# Altium project Nixie Alarm Clock - Display.PrjPcb
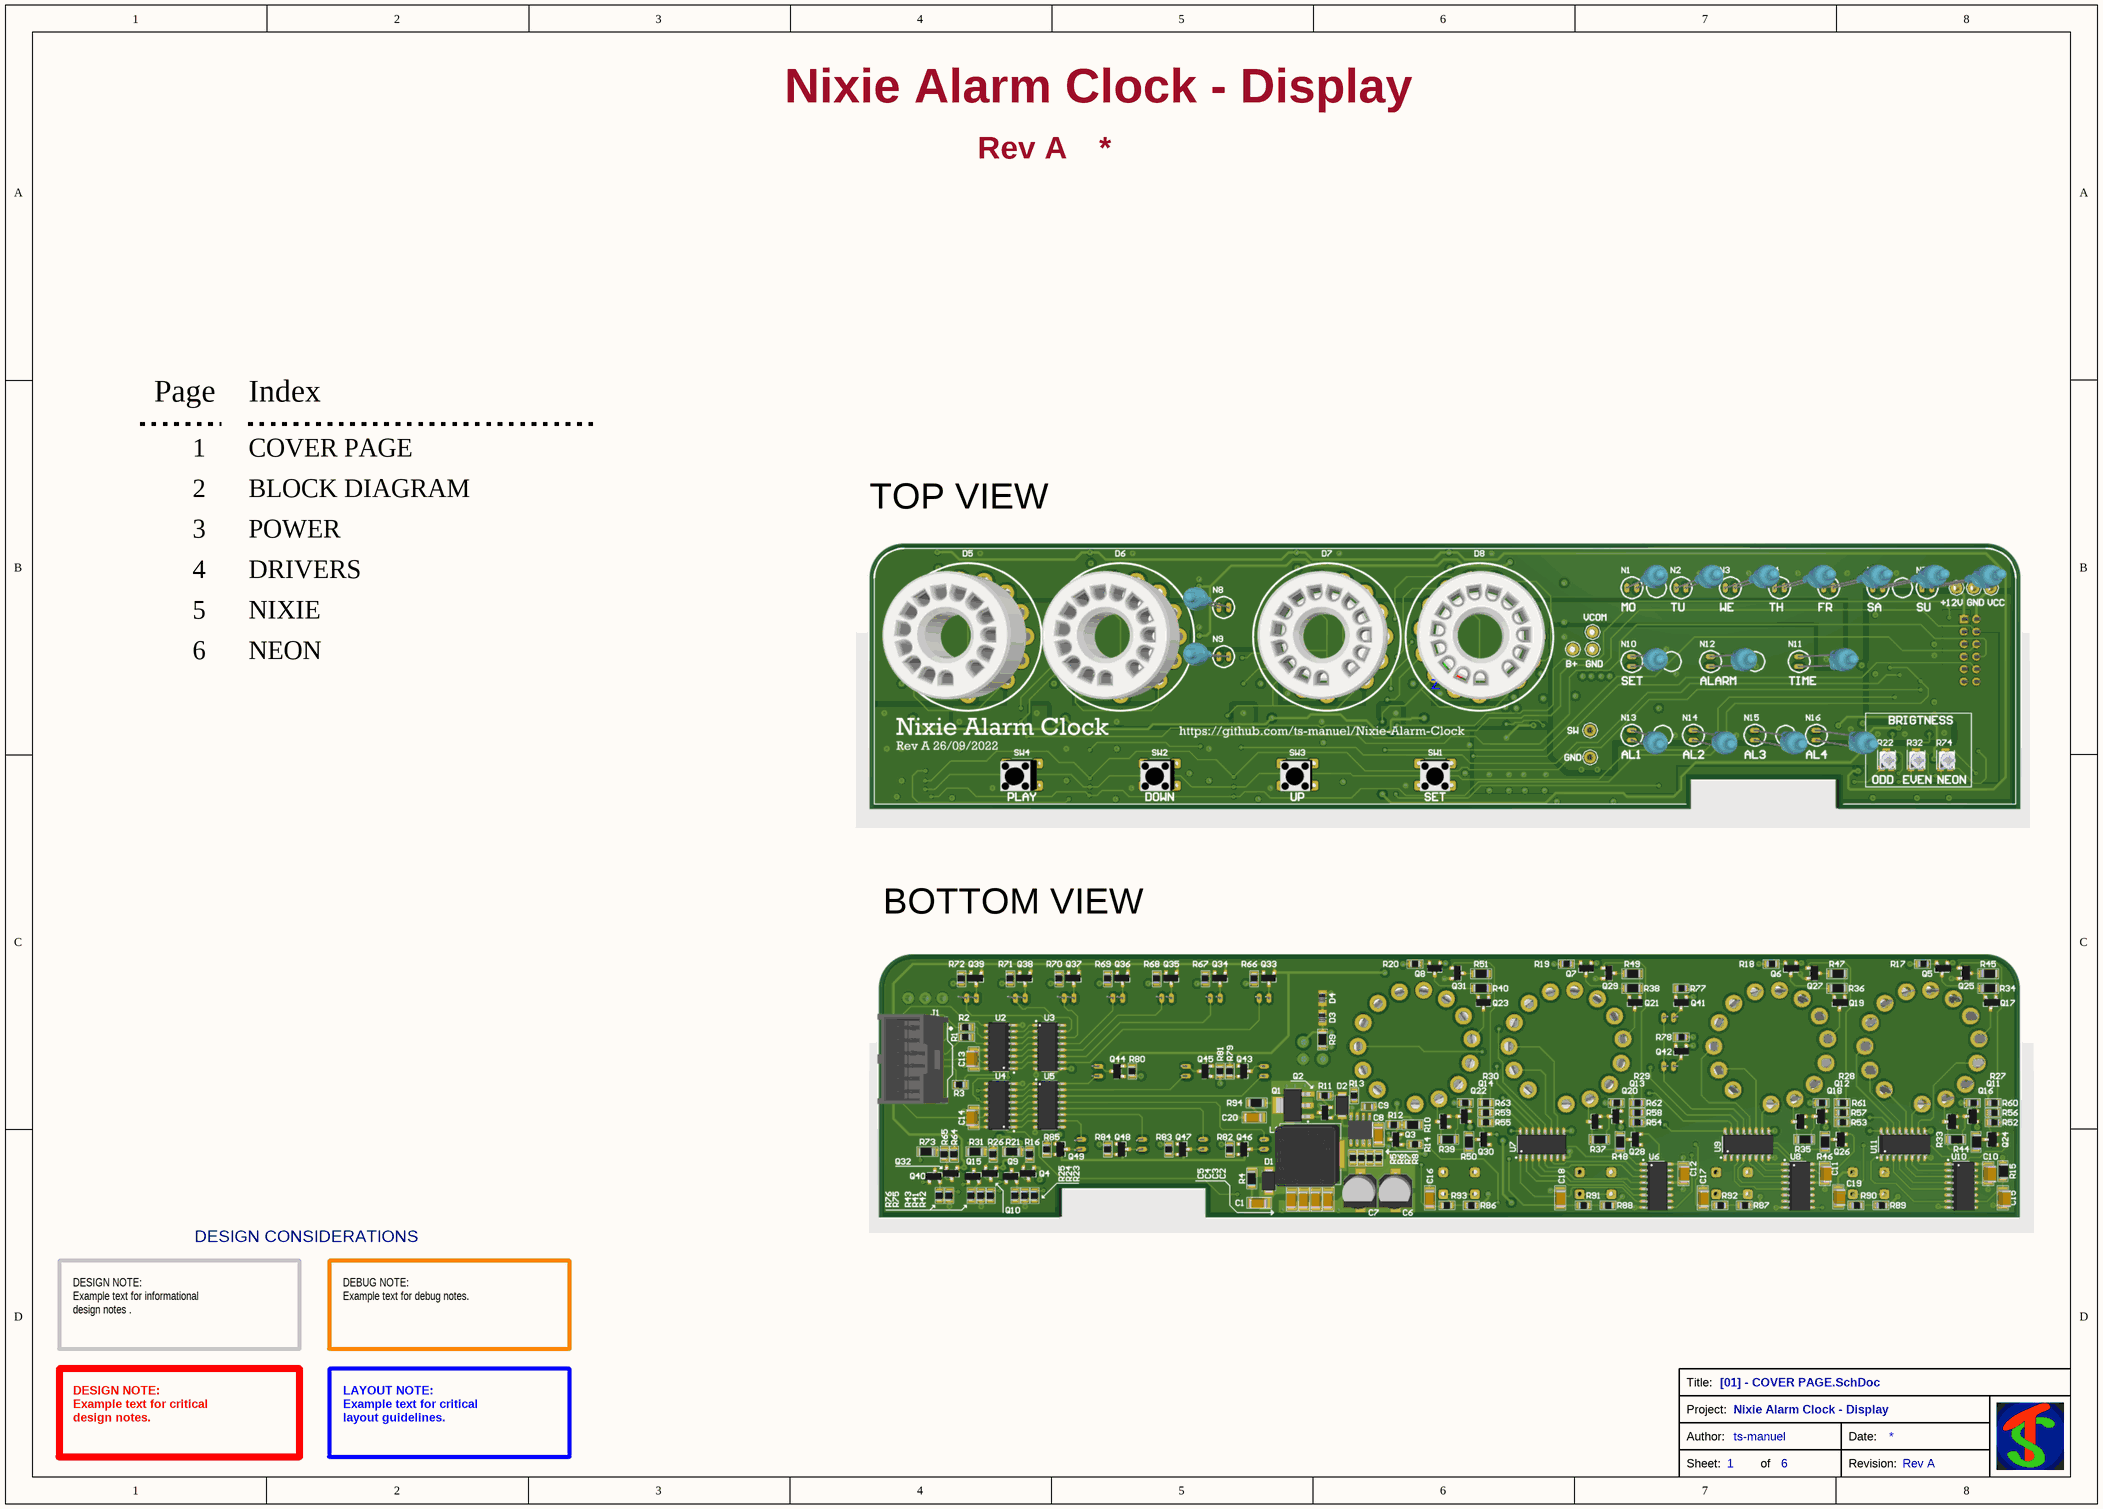
[diagram p0: [01] - COVER PAGE.SchDoc]
AuthorName: ts-manuel; GitHub: https://github.com/ts-manuel/Nixie-Alarm-Clock; ProjectRevision: Rev A; ProjectTitle: Nixie Alarm Clock - Display
6 sheets, 212 parts. Net scope: flat (ports and power ports of the same name join across sheets).
Board file: Display.PcbDoc
Sheets:
  [01] - COVER PAGE.SchDoc
  [02] - BLOCK DIAGRAM.SchDoc
  [03] - POWER.SchDoc
  [04] - DRIVERS.SchDoc
  [05] - NIXIE.SchDoc
  [06] - NEON.SchDoc

## Sheet [01] - COVER PAGE.SchDoc
size A3; DocumentNumber: 1; SheetNumber: 1; SheetTotal: 6

### Notes on the sheet
- Page
- Index
- 1
- 2
- COVER PAGE
- BLOCK DIAGRAM
- TOP VIEW
- 3
- 4
- POWER
- DRIVERS
- 5
- NIXIE
- 6
- NEON
- BOTTOM VIEW
- DESIGN CONSIDERATIONS
- DESIGN NOTE:
  Example text for informational
  design notes .
- DEBUG NOTE:
  Example text for debug notes.
- DESIGN NOTE:
  Example text for critical
  design notes.
- LAYOUT NOTE:
  Example text for critical
  layout guidelines.
- Title:
- Project:
- Sheet:
- Author:
- of
- Revision:
- Date:

## Sheet [02] - BLOCK DIAGRAM.SchDoc
size A3; DocumentNumber: 2; SheetNumber: 2; SheetTotal: 6
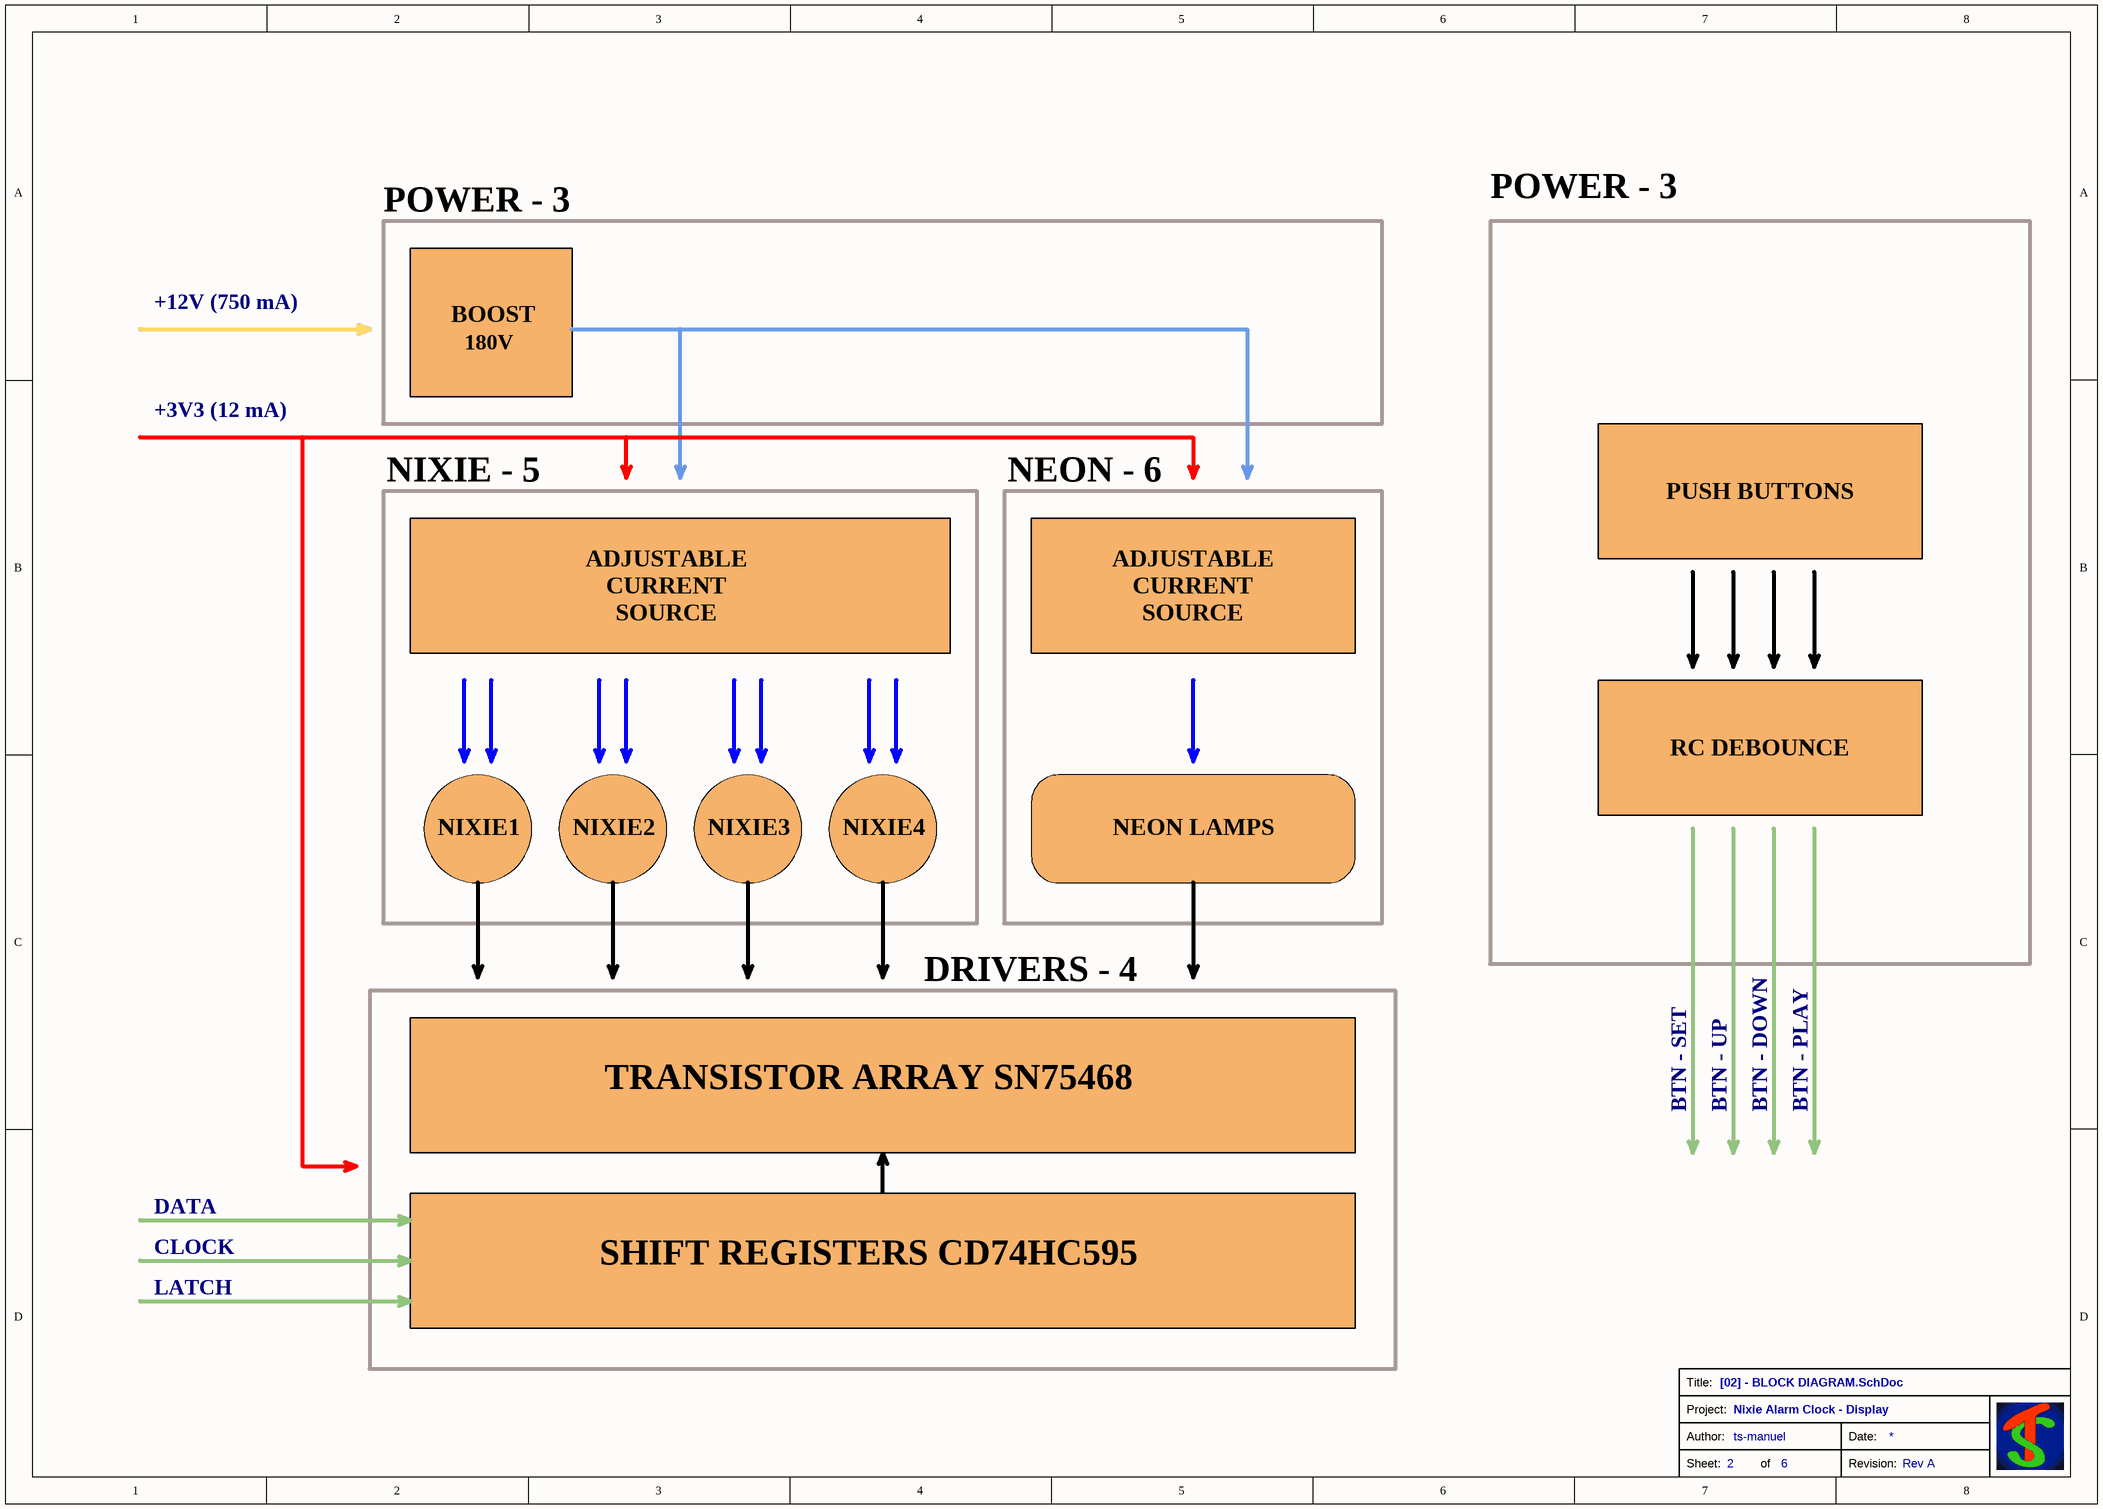
[diagram p1: [02] - BLOCK DIAGRAM.SchDoc]

### Notes on the sheet
- POWER - 3
- +12V (750 mA)
- BOOST
- 180V
- +3V3 (12 mA)
- NIXIE - 5
- NEON - 6
- PUSH BUTTONS
- ADJUSTABLE
- CURRENT
- SOURCE
- RC DEBOUNCE
- NIXIE1
- NIXIE2
- NIXIE3
- NIXIE4
- NEON LAMPS
- DRIVERS - 4
- TRANSISTOR ARRAY SN75468
- BTN - SET
- BTN - UP
- BTN - DOWN
- BTN - PLAY
- DATA
- CLOCK
- LATCH
- SHIFT REGISTERS CD74HC595
- Title:
- Project:
- Sheet:
- Author:
- of
- Revision:
- Date:

## Sheet [03] - POWER.SchDoc
size A3; DocumentNumber: 3; SheetNumber: 3; SheetTotal: 6
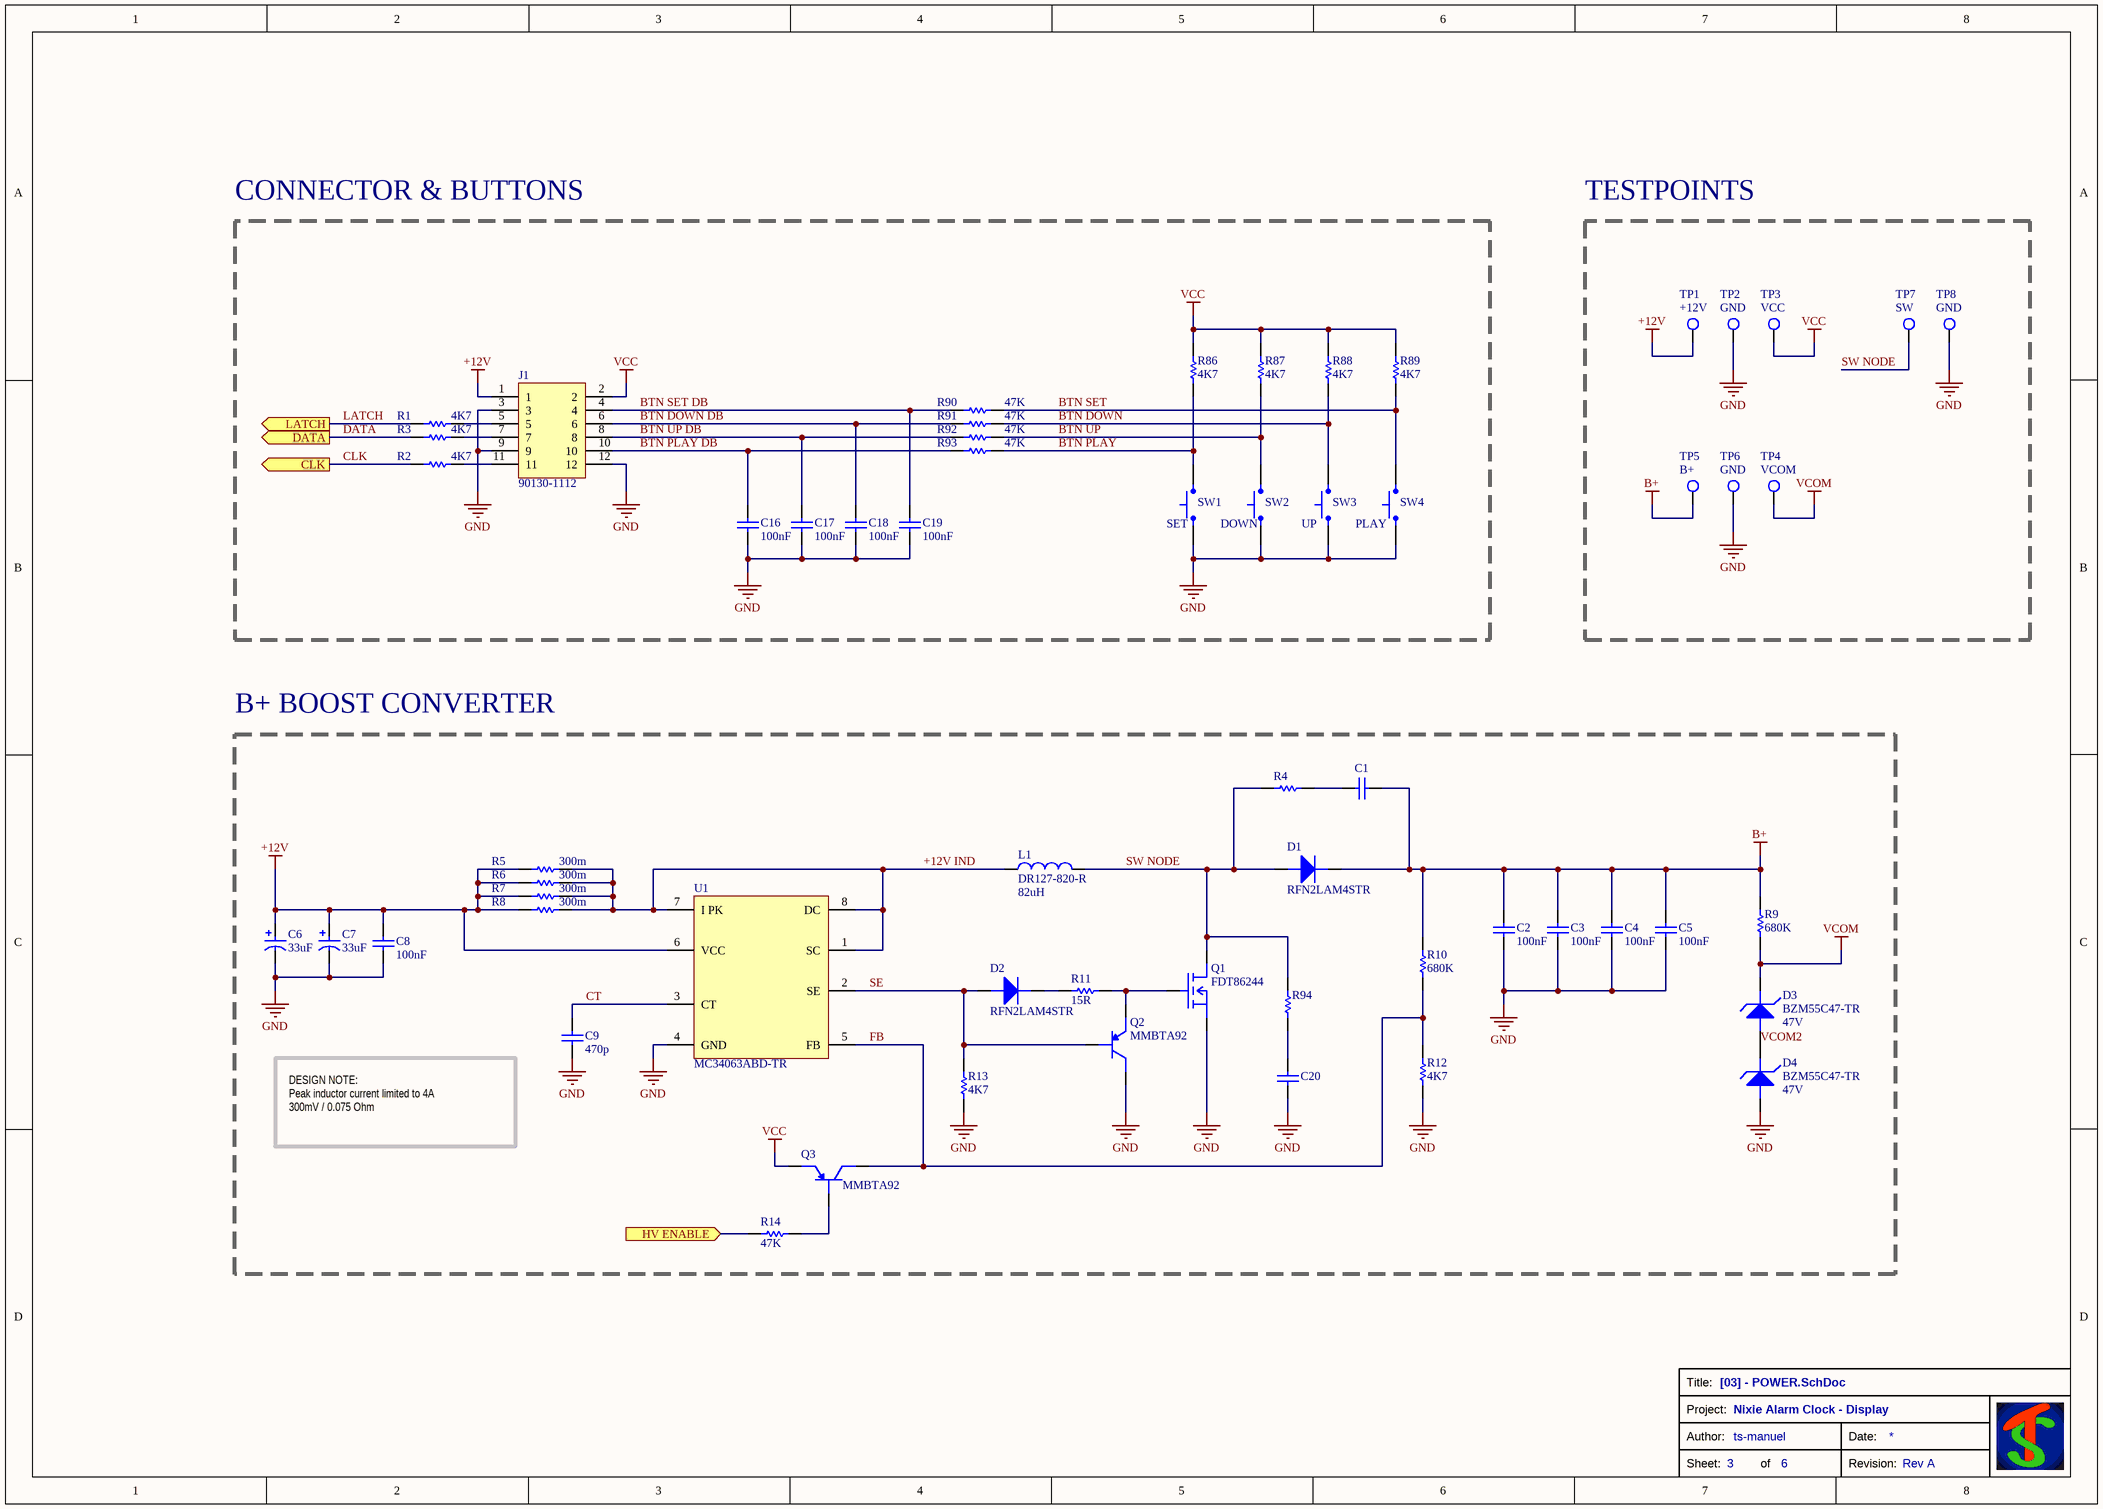
[diagram p2: [03] - POWER.SchDoc]

### Parts
C1  885342208002  [CAP-1206]  (value not drawn)
C2  value 100nF  [CAP-1206]  (hidden comment: 885342208002)
C3  value 100nF  [CAP-1206]  (hidden comment: 885342208002)
C4  value 100nF  [CAP-1206]  (hidden comment: 885342208002)
C5  value 100nF  [CAP-1206]  (hidden comment: 885342208002)
C6  value 33uF  [CAPAE7366X60M]  (hidden comment: A768EB336M1GLAE045)
C7  value 33uF  [CAPAE7366X60M]  (hidden comment: A768EB336M1GLAE045)
C8  value 100nF  [CAP-1206]  (hidden comment: 885342208002)
C9  value 470p  [CAP-0805]  (hidden comment: VJ0805A471JXBCW1BC)
C16  value 100nF  [CAP-1206]  (hidden comment: 885342208002)
C17  value 100nF  [CAP-1206]  (hidden comment: 885342208002)
C18  value 100nF  [CAP-1206]  (hidden comment: 885342208002)
C19  value 100nF  [CAP-1206]  (hidden comment: 885342208002)
C20  885342208002  [CAP-1206]  (value not drawn)
D1  RFN2LAM4STR  [SODFL472X100-2M]
D2  RFN2LAM4STR  [SODFL472X100-2M]
D3  BZM55C47-TR  Zener Voltage: 47V  [DIOMELF1913M]
D4  BZM55C47-TR  Zener Voltage: 47V  [DIOMELF1913M]
J1  90130-1112  [SHDR12W65P254_2X6_1758X975X1110P]
L1  DR127-820-R  value 82uH  [IND-DR127]
Q1  FDT86244  [SOT230P700X180-4M]
Q2  MMBTA92  [SOT95P240X110-3N]
Q3  MMBTA92  [SOT95P240X110-3N]
R1  value 4K7  [RES-0805]  (hidden comment: RT0805FRE134K7L)
R2  value 4K7  [RES-0805]  (hidden comment: RT0805FRE134K7L)
R3  value 4K7  [RES-0805]  (hidden comment: RT0805FRE134K7L)
R4  RT1206FRE07680KL  [RES-1206]  (value not drawn)
R5  value 300m  [RES-0805]  (hidden comment: ERJ-U6QFR30V)
R6  value 300m  [RES-0805]  (hidden comment: ERJ-U6QFR30V)
R7  value 300m  [RES-0805]  (hidden comment: ERJ-U6QFR30V)
R8  value 300m  [RES-0805]  (hidden comment: ERJ-U6QFR30V)
R9  value 680K  [RES-1206]  (hidden comment: RT1206FRE07680KL)
R10  value 680K  [RES-1206]  (hidden comment: RT1206FRE07680KL)
R11  value 15R  [RES-0805]  (hidden comment: CR0805-JW-150ELF)
R12  value 4K7  [RES-0805]  (hidden comment: RT0805FRE134K7L)
R13  value 4K7  [RES-0805]  (hidden comment: RT0805FRE134K7L)
R14  value 47K  [RES-0805]  (hidden comment: RT0805FRE0747KL)
R86  value 4K7  [RES-0805]  (hidden comment: RT0805FRE134K7L)
R87  value 4K7  [RES-0805]  (hidden comment: RT0805FRE134K7L)
R88  value 4K7  [RES-0805]  (hidden comment: RT0805FRE134K7L)
R89  value 4K7  [RES-0805]  (hidden comment: RT0805FRE134K7L)
R90  value 47K  [RES-0805]  (hidden comment: RT0805FRE0747KL)
R91  value 47K  [RES-0805]  (hidden comment: RT0805FRE0747KL)
R92  value 47K  [RES-0805]  (hidden comment: RT0805FRE0747KL)
R93  value 47K  [RES-0805]  (hidden comment: RT0805FRE0747KL)
R94  RT1206FRE07680KL  [RES-1206]  (value not drawn)
SW1  SET  [Push Button 6mm TH]
SW2  DOWN  [Push Button 6mm TH]
SW3  UP  [Push Button 6mm TH]
SW4  PLAY  [Push Button 6mm TH]
TP1  +12V  [TESTPOINT-TH-1.3mm]  (no BOM)
TP2  GND  [TESTPOINT-TH-1.3mm]  (no BOM)
TP3  VCC  [TESTPOINT-TH-1.3mm]  (no BOM)
TP4  VCOM  [TESTPOINT-TH-1.3mm]  (no BOM)
TP5  B+  [TESTPOINT-TH-1.3mm]  (no BOM)
TP6  GND  [TESTPOINT-TH-1.3mm]  (no BOM)
TP7  SW  [TESTPOINT-TH-1.3mm]  (no BOM)
TP8  GND  [TESTPOINT-TH-1.3mm]  (no BOM)
U1  MC34063ABD-TR  [SOIC-8_3.9X4.9]

### Blocks framed on the sheet
CONNECTOR & BUTTONS: C16-C19 J1 R1-R3 R86-R93 SW1-SW4
TESTPOINTS: TP1-TP8
B+ BOOST CONVERTER: C1-C9 C20 D1-D4 L1 Q1-Q3 R4-R14 R94 U1

### Ports
CLK (out), DATA (out), HV ENABLE (in), LATCH (out)

### Nets
+12V: C6.1(P) C7.1(P) C8.2 J1.1 R5.1 R6.1 R7.1 R8.1 TP1.1 U1.6(VCC)
B+: C1.1 C2.2 C3.2 C4.2 C5.2 D1.2(C) R9.2 R10.2 TP5.1
GND: C2.1 C3.1 C4.1 C5.1 C6.2(N) C7.2(N) C8.1 C9.1 C16.1 C17.1 C18.1 C19.1 C20.1 D4.1(A) J1.3 J1.9 J1.12 Q1.3(SOURCE) Q2.3(C) R12.1 R13.1 SW1.1 SW2.1 SW3.1 SW4.1 TP2.1 TP6.1 TP8.1 U1.4(GND)
VCC: J1.2 Q3.2(E) R86.2 R87.2 R88.2 R89.2 TP3.1
VCOM: D3.2(C) R9.1 TP4.1
+12V IND: L1.1 R5.2 R6.2 R7.2 R8.2 U1.1(SC) U1.7(I_PK) U1.8(DC)
BTN DOWN: R88.1 R91.2 SW3.2
BTN DOWN DB: C18.2 J1.6 R91.1
BTN PLAY: R86.1 R93.2 SW1.2
BTN PLAY DB: C16.2 J1.10 R93.1
BTN SET: R89.1 R90.2 SW4.2
BTN SET DB: C19.2 J1.4 R90.1
BTN UP: R87.1 R92.2 SW2.2
BTN UP DB: C17.2 J1.8 R92.1
CLK: R2.1 ; port CLK
CT: C9.2 U1.3(CT)
DATA: R3.1 ; port DATA
FB: Q3.3(C) R10.1 R12.2 U1.5(FB)
HV ENABLE: R14.1 ; port HV ENABLE
LATCH: R1.1 ; port LATCH
SE: D2.1(A) Q2.1(B) R13.2 U1.2(SE)
SW NODE: D1.1(A) L1.2 Q1.2(DRAIN) R4.2 R94.2 TP7.1
VCOM2: D3.1(A) D4.2(C)
NetC1_2: C1.2 R4.1
NetC20_2: C20.2 R94.1
NetD2_2: D2.2(C) R11.1
NetJ1_5: J1.5 R1.2
NetJ1_7: J1.7 R3.2
NetJ1_11: J1.11 R2.2
NetQ1_1: Q1.1(GATE) Q2.2(E) R11.2
NetQ3_1: Q3.1(B) R14.2

### Notes on the sheet
- DESIGN NOTE:
  Peak inductor current limited to 4A
  300mV / 0.075 Ohm
  Max output current 40mA
- Title:
- Project:
- Sheet:
- Author:
- of
- Revision:
- Date:

### Library data of the parts
C1 C20 = CAP-1206-100n-885342208002: Condensatori in ceramica multistrato MLCC - SMD/SMT WCAP-CSMH 200V 0.1uF 1206 10%; Manufacturer: Wurth Elektronik; Dielectric: X7R; Value: 100nF; Voltage Rating: 200V; Tolerance: 10%; Supplier 1: Mouser; Supplier Part Number 1: 710-885342208002
C2-C5 C8 C16-C19 = CAP-1206-100n-885342208002: Condensatori in ceramica multistrato MLCC - SMD/SMT WCAP-CSMH 200V 0.1uF 1206 10%; Manufacturer: Wurth Elektronik; Dielectric: X7R; Voltage Rating: 200V; Tolerance: 10%; Supplier 1: Mouser; Supplier Part Number 1: 710-885342208002
C6 C7 = CAP-CAN-33u-A768EB336M1GLAE045: Condensatori a polimeri organici in alluminio 40V 33uF 20% ESR=45mOhms; Manufacturer: KEMET; Voltage Rating DC: 16 VDC; Voltage Rating: 16V; Dielectric: X7R; Tolerance: 20%; Supplier 1: Mouser; Supplier Part Number 1: 80-A768EB336M1GLAE45
C9 = CAP-0805-470p-VJ0805A471JXBCW1BC: Condensatori in ceramica multistrato MLCC - SMD/SMT 0805 470pF 100volts C0G 5%; Manufacturer: Wurth Elektronik; Voltage Rating DC: 16 VDC; Voltage Rating: 16V; Tolerance: 20%; Dielectric: X5R; Supplier 1: Mouser; Supplier Part Number 1: 77-VJ0805A471JXBCBC
D1 D2 = DIODE-RFN2LAM4STR: Diodi - Uso generico, alimentazione, commutazione 400V 1.5A Io PMDTM; Supplier 1: Mouser; Supplier Part Number 1: 755-RFN2LAM4STR; Reverse Voltage: 400V; Forward Current: 1.5A
D3 D4 = ZENER-47V-BZM55C47-TR: Diodi Zener 47 Volt 0.5W 5%; Supplier 1: Mouser; Supplier Part Number 1: 78-BZM55C47
J1 = HEADER-12x2-2.54-TH-90130-1112: Terminali e capicorda 2.54MM CGRIDIII HDR 12P V DR SHRD TIN; Manufacturer_Name: Molex; Datasheet Link: https://www.molex.com/pdm_docs/sd/901301112_sd.pdf; Height: 11.1mm; Manufacturer_Part_Number: 90130-1112; Supplier 1: Mouser; Supplier Part Number 1: 538-90130-1112
L1 = IND-DR127-82u: Induttori fissi 82uH 4.0A 0.143ohms; Manufacturer: Taiyo Yuden; Tolerance: 30%; Max DC Current: 4A; Max DC Resistance: 143m; Supplier 1: Mouser; Supplier Part Number 1: 704-DR127-820-R
Q1 = NMOS-FDT86244: MOSFET 150V N-Channel PowerTrench MOSFET; Supplier 1: Mouser; Supplier Part Number 1: 512-FDT86244
Q2 Q3 = PNP-MMBTA92: 300V PNP SMALL SIGNAL TRANSISTOR IN SOT23; Supplier 1: Mouser; Supplier Part Number 1: 621-MMBTA92-F
R1-R3 R12 R13 R86-R89 = RES-0805-4K7-RT0805FRE134K7L: Thin Film Resistors 4.7K ohm 1% 50 ppm; Manufacturer: Yageo; Power Rating: 1/10W; Voltage Rating: 75V; Tolerance: 1%; Supplier 1: Mouser; Supplier Part Number 1: 603-RT0805FRE134K7L
R4 R9 R10 R94 = RES-1206-680K-RT1206FRE07680KL: Thin Film Resistors 680K OHM 1% 50PPM 1/4W; Manufacturer: Yageo; Power Rating: 1/10W; Voltage Rating: 75V; Tolerance: 1%; Supplier 1: Mouser; Supplier Part Number 1: 603-RT1206FRE07680KL
  R4 R94: Value: 680K
R5-R8 = RES-0805-300m-ERJ-U6QFR30V: Resistori a pellicola spessa - SMD 0805 0.25W 1% .30ohms AEC-Q200; Manufacturer: Yageo; Power Rating: 1/10W; Voltage Rating: 75V; Tolerance: 1%; Supplier 1: Mouser; Supplier Part Number 1: 667-ERJ-U6QFR30V
R11 = RES-0805-15R-ERJ-CR0805-JW-150ELF: Resistori a pellicola spessa - SMD 15ohm 5%; Manufacturer: Bourns; Power Rating: 1/8W; Voltage Rating: 150V; Tolerance: 5%; Supplier 1: Mouser; Supplier Part Number 1: 652-CR0805JW-150ELF
R14 R90-R93 = RES-0805-47K-RT0805FRE0747KL: Thin Film Resistors 1/8W 47K ohm 1% 50ppm; Manufacturer: Yageo; Power Rating: 1/10W; Voltage Rating: 75V; Tolerance: 1%; Supplier 1: Mouser; Supplier Part Number 1: 603-RT0805FRE0747KL
SW1-SW4 = Push Button 6mm TH
TP1-TP8 = TESTPOINT-TH-1.3mm
U1 = MC34063ABD-TR: DC-DC Converter 3.0 to 40V; Supplier 1: Mouser; Supplier Part Number 1: 511-MC34063ABD-TR

## Sheet [04] - DRIVERS.SchDoc
size A3; DocumentNumber: 4; SheetNumber: 4; SheetTotal: 6
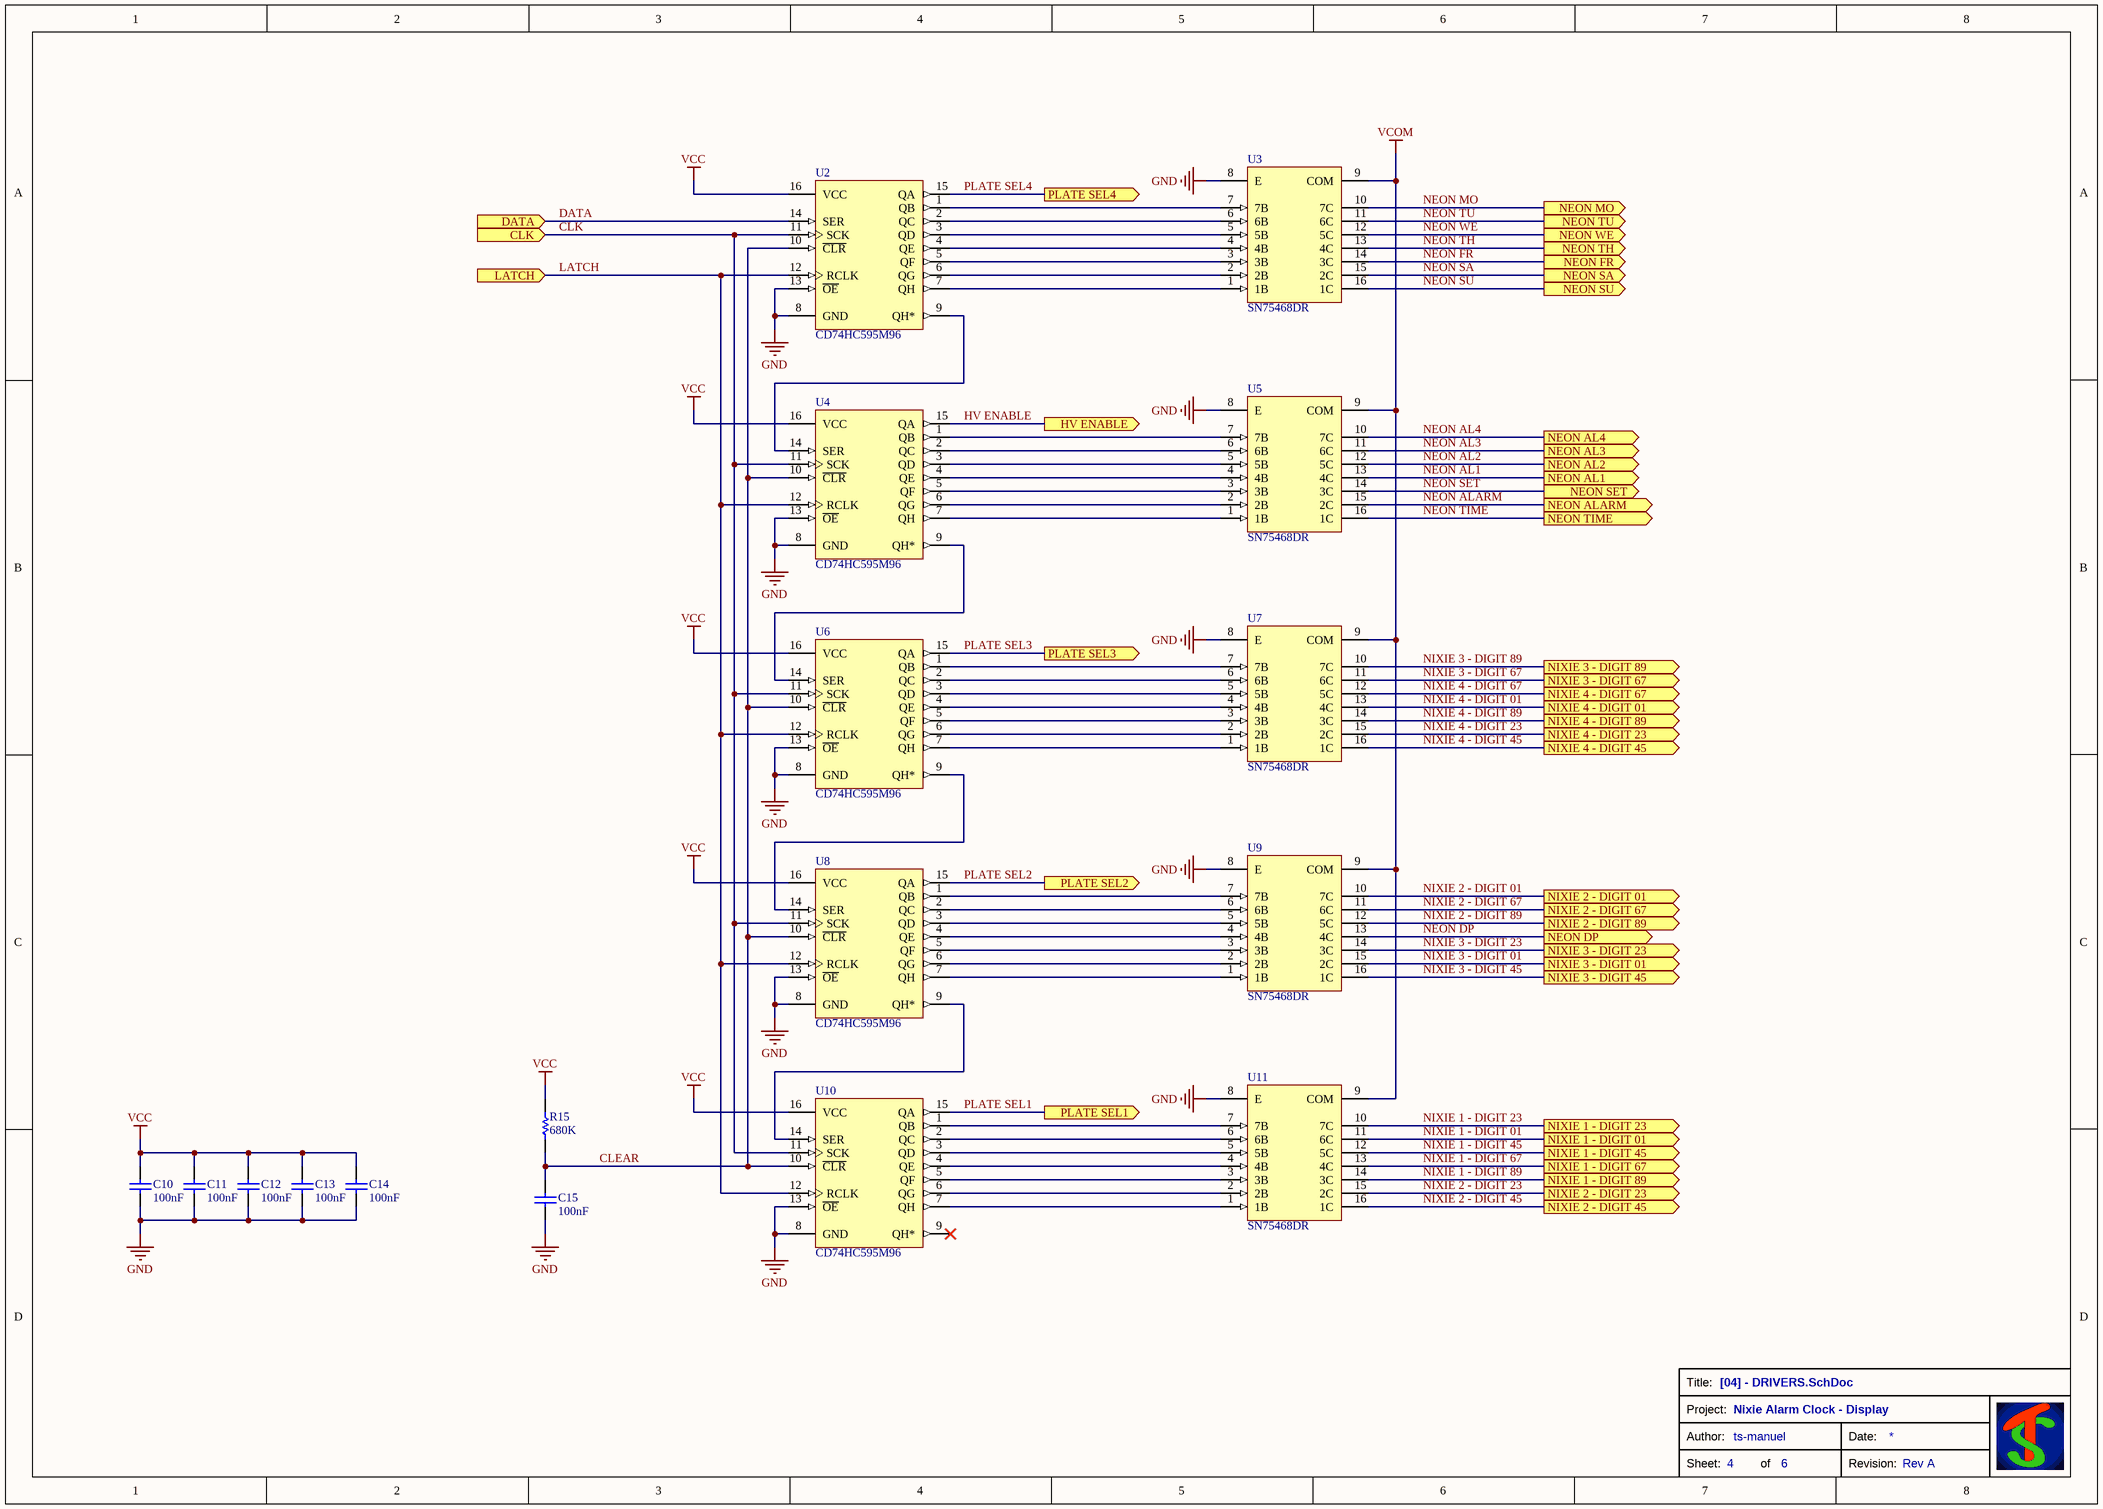
[diagram p3: [04] - DRIVERS.SchDoc]

### Parts
C10  value 100nF  [CAP-1206]  (hidden comment: 885342208002)
C11  value 100nF  [CAP-1206]  (hidden comment: 885342208002)
C12  value 100nF  [CAP-1206]  (hidden comment: 885342208002)
C13  value 100nF  [CAP-1206]  (hidden comment: 885342208002)
C14  value 100nF  [CAP-1206]  (hidden comment: 885342208002)
C15  value 100nF  [CAP-1206]  (hidden comment: 885342208002)
R15  value 680K  [RES-1206]  (hidden comment: RT1206FRE07680KL)
U2  CD74HC595M96  [SOIC127P600X175-16N]
U3  SN75468DR  [SOIC127P600X175-16N]
U4  CD74HC595M96  [SOIC127P600X175-16N]
U5  SN75468DR  [SOIC127P600X175-16N]
U6  CD74HC595M96  [SOIC127P600X175-16N]
U7  SN75468DR  [SOIC127P600X175-16N]
U8  CD74HC595M96  [SOIC127P600X175-16N]
U9  SN75468DR  [SOIC127P600X175-16N]
U10  CD74HC595M96  [SOIC127P600X175-16N]
U11  SN75468DR  [SOIC127P600X175-16N]

### Ports
CLK (in), DATA (in), HV ENABLE (out), LATCH (in), NEON AL1 (out), NEON AL2 (out), NEON AL3 (out), NEON AL4 (out), NEON ALARM (out), NEON DP (out), NEON FR (out), NEON MO (out), NEON SA (out), NEON SET (out), NEON SU (out), NEON TH (out), NEON TIME (out), NEON TU (out), NEON WE (out), NIXIE 1 - DIGIT 01 (out), NIXIE 1 - DIGIT 23 (out), NIXIE 1 - DIGIT 45 (out), NIXIE 1 - DIGIT 67 (out), NIXIE 1 - DIGIT 89 (out), NIXIE 2 - DIGIT 01 (out), NIXIE 2 - DIGIT 23 (out), NIXIE 2 - DIGIT 45 (out), NIXIE 2 - DIGIT 67 (out), NIXIE 2 - DIGIT 89 (out), NIXIE 3 - DIGIT 01 (out), NIXIE 3 - DIGIT 23 (out), NIXIE 3 - DIGIT 45 (out), NIXIE 3 - DIGIT 67 (out), NIXIE 3 - DIGIT 89 (out), NIXIE 4 - DIGIT 01 (out), NIXIE 4 - DIGIT 23 (out), NIXIE 4 - DIGIT 45 (out), NIXIE 4 - DIGIT 67 (out), NIXIE 4 - DIGIT 89 (out), PLATE SEL1 (out), PLATE SEL2 (out), PLATE SEL3 (out), PLATE SEL4 (out)

### Nets
GND: C10.1 C11.1 C12.1 C13.1 C14.1 C15.1 U2.8(GND) U2.13(~{OE}) U3.8(E) U4.8(GND) U4.13(~{OE}) U5.8(E) U6.8(GND) U6.13(~{OE}) U7.8(E) U8.8(GND) U8.13(~{OE}) U9.8(E) U10.8(GND) U10.13(~{OE}) U11.8(E)
VCC: C10.2 C11.2 C12.2 C13.2 C14.2 R15.2 U2.16(VCC) U4.16(VCC) U6.16(VCC) U8.16(VCC) U10.16(VCC)
VCOM: U3.9(COM) U5.9(COM) U7.9(COM) U9.9(COM) U11.9(COM)
CLEAR: C15.2 R15.1 U2.10(~{CLR}) U4.10(~{CLR}) U6.10(~{CLR}) U8.10(~{CLR}) U10.10(~{CLR})
CLK: U2.11(SCK) U4.11(SCK) U6.11(SCK) U8.11(SCK) U10.11(SCK) ; port CLK
DATA: U2.14(SER) ; port DATA
HV ENABLE: U4.15(QA) ; port HV ENABLE
LATCH: U2.12(RCLK) U4.12(RCLK) U6.12(RCLK) U8.12(RCLK) U10.12(RCLK) ; port LATCH
NEON AL1: U5.13(4C) ; port NEON AL1
NEON AL2: U5.12(5C) ; port NEON AL2
NEON AL3: U5.11(6C) ; port NEON AL3
NEON AL4: U5.10(7C) ; port NEON AL4
NEON ALARM: U5.15(2C) ; port NEON ALARM
NEON DP: U9.13(4C) ; port NEON DP
NEON FR: U3.14(3C) ; port NEON FR
NEON MO: U3.10(7C) ; port NEON MO
NEON SA: U3.15(2C) ; port NEON SA
NEON SET: U5.14(3C) ; port NEON SET
NEON SU: U3.16(1C) ; port NEON SU
NEON TH: U3.13(4C) ; port NEON TH
NEON TIME: U5.16(1C) ; port NEON TIME
NEON TU: U3.11(6C) ; port NEON TU
NEON WE: U3.12(5C) ; port NEON WE
NIXIE 1 - DIGIT 01: U11.11(6C) ; port NIXIE 1 - DIGIT 01
NIXIE 1 - DIGIT 23: U11.10(7C) ; port NIXIE 1 - DIGIT 23
NIXIE 1 - DIGIT 45: U11.12(5C) ; port NIXIE 1 - DIGIT 45
NIXIE 1 - DIGIT 67: U11.13(4C) ; port NIXIE 1 - DIGIT 67
NIXIE 1 - DIGIT 89: U11.14(3C) ; port NIXIE 1 - DIGIT 89
NIXIE 2 - DIGIT 01: U9.10(7C) ; port NIXIE 2 - DIGIT 01
NIXIE 2 - DIGIT 23: U11.15(2C) ; port NIXIE 2 - DIGIT 23
NIXIE 2 - DIGIT 45: U11.16(1C) ; port NIXIE 2 - DIGIT 45
NIXIE 2 - DIGIT 67: U9.11(6C) ; port NIXIE 2 - DIGIT 67
NIXIE 2 - DIGIT 89: U9.12(5C) ; port NIXIE 2 - DIGIT 89
NIXIE 3 - DIGIT 01: U9.15(2C) ; port NIXIE 3 - DIGIT 01
NIXIE 3 - DIGIT 23: U9.14(3C) ; port NIXIE 3 - DIGIT 23
NIXIE 3 - DIGIT 45: U9.16(1C) ; port NIXIE 3 - DIGIT 45
NIXIE 3 - DIGIT 67: U7.11(6C) ; port NIXIE 3 - DIGIT 67
NIXIE 3 - DIGIT 89: U7.10(7C) ; port NIXIE 3 - DIGIT 89
NIXIE 4 - DIGIT 01: U7.13(4C) ; port NIXIE 4 - DIGIT 01
NIXIE 4 - DIGIT 23: U7.15(2C) ; port NIXIE 4 - DIGIT 23
NIXIE 4 - DIGIT 45: U7.16(1C) ; port NIXIE 4 - DIGIT 45
NIXIE 4 - DIGIT 67: U7.12(5C) ; port NIXIE 4 - DIGIT 67
NIXIE 4 - DIGIT 89: U7.14(3C) ; port NIXIE 4 - DIGIT 89
PLATE SEL1: U10.15(QA) ; port PLATE SEL1
PLATE SEL2: U8.15(QA) ; port PLATE SEL2
PLATE SEL3: U6.15(QA) ; port PLATE SEL3
PLATE SEL4: U2.15(QA) ; port PLATE SEL4
NetU2_1: U2.1(QB) U3.7(7B)
NetU2_2: U2.2(QC) U3.6(6B)
NetU2_3: U2.3(QD) U3.5(5B)
NetU2_4: U2.4(QE) U3.4(4B)
NetU2_5: U2.5(QF) U3.3(3B)
NetU2_6: U2.6(QG) U3.2(2B)
NetU2_7: U2.7(QH) U3.1(1B)
NetU2_9: U2.9(QH*) U4.14(SER)
NetU4_1: U4.1(QB) U5.7(7B)
NetU4_2: U4.2(QC) U5.6(6B)
NetU4_3: U4.3(QD) U5.5(5B)
NetU4_4: U4.4(QE) U5.4(4B)
NetU4_5: U4.5(QF) U5.3(3B)
NetU4_6: U4.6(QG) U5.2(2B)
NetU4_7: U4.7(QH) U5.1(1B)
NetU4_9: U4.9(QH*) U6.14(SER)
NetU6_1: U6.1(QB) U7.7(7B)
NetU6_2: U6.2(QC) U7.6(6B)
NetU6_3: U6.3(QD) U7.5(5B)
NetU6_4: U6.4(QE) U7.4(4B)
NetU6_5: U6.5(QF) U7.3(3B)
NetU6_6: U6.6(QG) U7.2(2B)
NetU6_7: U6.7(QH) U7.1(1B)
NetU6_9: U6.9(QH*) U8.14(SER)
NetU8_1: U8.1(QB) U9.7(7B)
NetU8_2: U8.2(QC) U9.6(6B)
NetU8_3: U8.3(QD) U9.5(5B)
NetU8_4: U8.4(QE) U9.4(4B)
NetU8_5: U8.5(QF) U9.3(3B)
NetU8_6: U8.6(QG) U9.2(2B)
NetU8_7: U8.7(QH) U9.1(1B)
NetU8_9: U8.9(QH*) U10.14(SER)
NetU10_1: U10.1(QB) U11.7(7B)
NetU10_2: U10.2(QC) U11.6(6B)
NetU10_3: U10.3(QD) U11.5(5B)
NetU10_4: U10.4(QE) U11.4(4B)
NetU10_5: U10.5(QF) U11.3(3B)
NetU10_6: U10.6(QG) U11.2(2B)
NetU10_7: U10.7(QH) U11.1(1B)

Not connected (* = marked no-connect by the designer): U10 9(QH*)*

### Notes on the sheet
- Title:
- Project:
- Sheet:
- Author:
- of
- Revision:
- Date:

### Library data of the parts
C10-C15 = CAP-1206-100n-885342208002: Condensatori in ceramica multistrato MLCC - SMD/SMT WCAP-CSMH 200V 0.1uF 1206 10%; Manufacturer: KEMET; Voltage Rating DC: 16 VDC; Voltage Rating: 16V; Tolerance: 20%; Dielectric: X7R; Supplier 1: Mouser; Supplier Part Number 1: 710-885342208002
R15 = RES-1206-680K-RT1206FRE07680KL: as R4 on sheet [03] - POWER; Tolerance: 1%; Supplier 1: Mouser; Supplier Part Number 1: 603-RT1206FRE07680KL
U2 U4 U6 U8 U10 = CD74HC595: 8-Bit Shift Register; Supplier 1: Mouser; Supplier Part Number 1: 595-CD74HC595M96
U3 U5 U7 U9 U11 = SN75468: High Voltage Darlington Transistor Arrays; Supplier 1: Mouser; Supplier Part Number 1: 595-SN75468DR

## Sheet [05] - NIXIE.SchDoc
size A3; DocumentNumber: 5; SheetNumber: 5; SheetTotal: 6
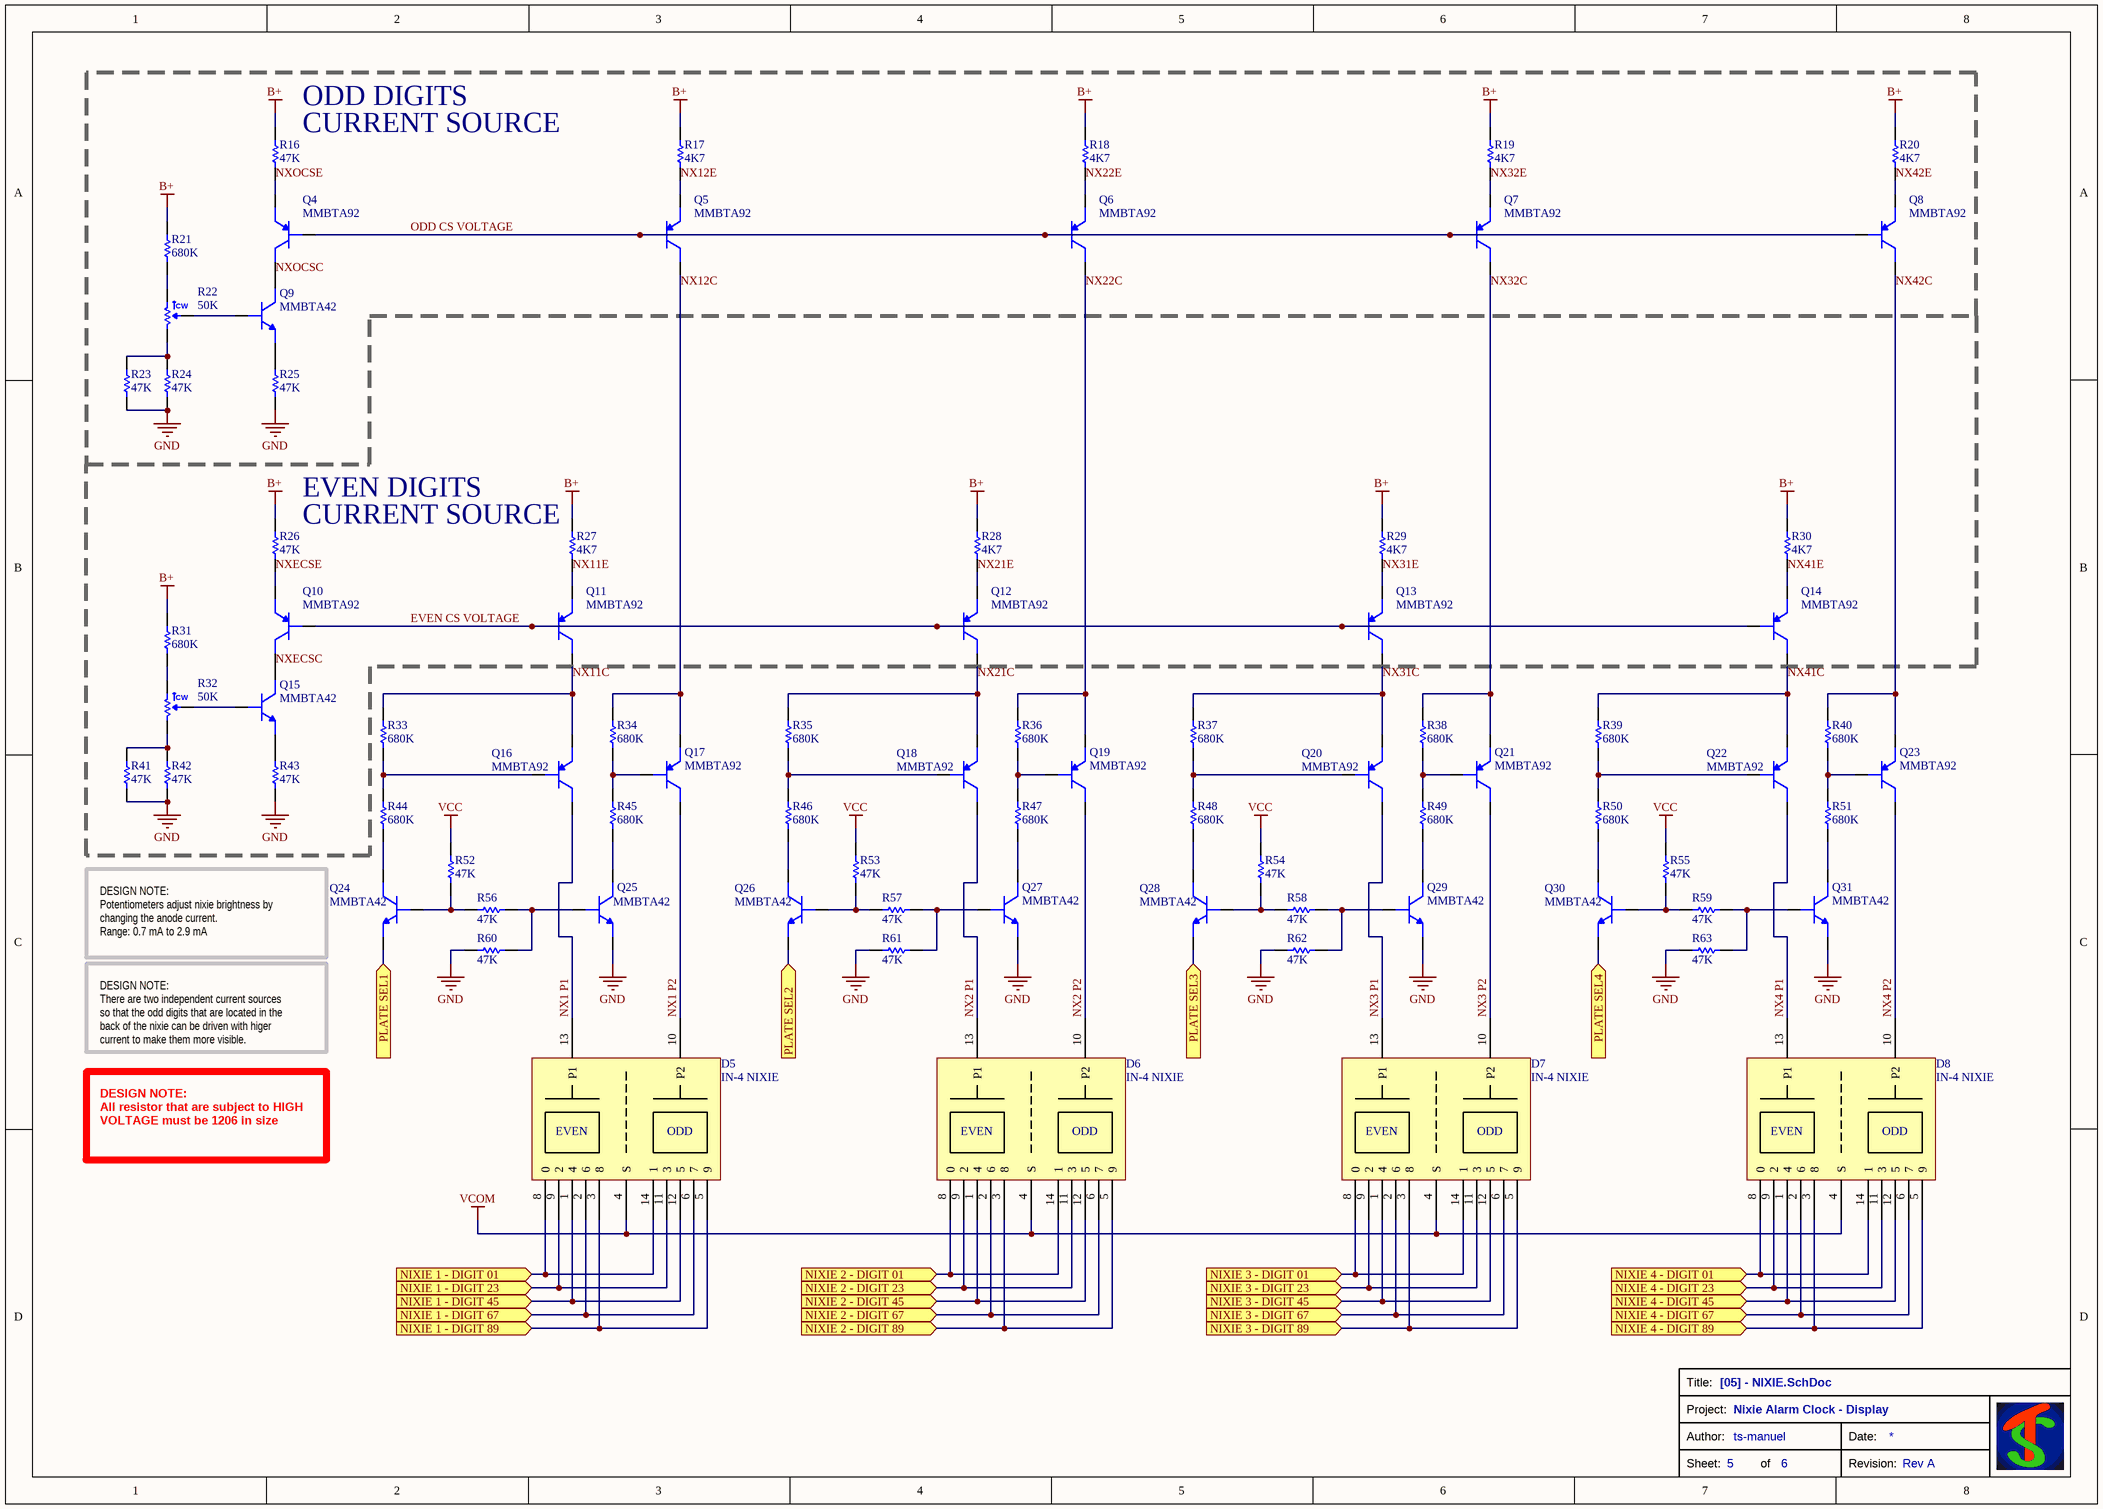
[diagram p4: [05] - NIXIE.SchDoc]

### Parts
D5  IN-4 NIXIE  [IN4 NIXIE]
D6  IN-4 NIXIE  [IN4 NIXIE]
D7  IN-4 NIXIE  [IN4 NIXIE]
D8  IN-4 NIXIE  [IN4 NIXIE]
Q4  MMBTA92  [SOT95P240X110-3N]
Q5  MMBTA92  [SOT95P240X110-3N]
Q6  MMBTA92  [SOT95P240X110-3N]
Q7  MMBTA92  [SOT95P240X110-3N]
Q8  MMBTA92  [SOT95P240X110-3N]
Q9  MMBTA42  [SOT95P240X110-3N]
Q10  MMBTA92  [SOT95P240X110-3N]
Q11  MMBTA92  [SOT95P240X110-3N]
Q12  MMBTA92  [SOT95P240X110-3N]
Q13  MMBTA92  [SOT95P240X110-3N]
Q14  MMBTA92  [SOT95P240X110-3N]
Q15  MMBTA42  [SOT95P240X110-3N]
Q16  MMBTA92  [SOT95P240X110-3N]
Q17  MMBTA92  [SOT95P240X110-3N]
Q18  MMBTA92  [SOT95P240X110-3N]
Q19  MMBTA92  [SOT95P240X110-3N]
Q20  MMBTA92  [SOT95P240X110-3N]
Q21  MMBTA92  [SOT95P240X110-3N]
Q22  MMBTA92  [SOT95P240X110-3N]
Q23  MMBTA92  [SOT95P240X110-3N]
Q24  MMBTA42  [SOT95P240X110-3N]
Q25  MMBTA42  [SOT95P240X110-3N]
Q26  MMBTA42  [SOT95P240X110-3N]
Q27  MMBTA42  [SOT95P240X110-3N]
Q28  MMBTA42  [SOT95P240X110-3N]
Q29  MMBTA42  [SOT95P240X110-3N]
Q30  MMBTA42  [SOT95P240X110-3N]
Q31  MMBTA42  [SOT95P240X110-3N]
R16  value 47K  [RES-0805]  (hidden comment: RT0805FRE0747KL)
R17  value 4K7  [RES-0805]  (hidden comment: RT0805FRE134K7L)
R18  value 4K7  [RES-0805]  (hidden comment: RT0805FRE134K7L)
R19  value 4K7  [RES-0805]  (hidden comment: RT0805FRE134K7L)
R20  value 4K7  [RES-0805]  (hidden comment: RT0805FRE134K7L)
R21  value 680K  [RES-1206]  (hidden comment: RT1206FRE07680KL)
R22  value 50K  [TC33X2503E]  (hidden comment: ODD)
R23  value 47K  [RES-0805]  (hidden comment: RT0805FRE0747KL)
R24  value 47K  [RES-0805]  (hidden comment: RT0805FRE0747KL)
R25  value 47K  [RES-0805]  (hidden comment: RT0805FRE0747KL)
R26  value 47K  [RES-0805]  (hidden comment: RT0805FRE0747KL)
R27  value 4K7  [RES-0805]  (hidden comment: RT0805FRE134K7L)
R28  value 4K7  [RES-0805]  (hidden comment: RT0805FRE134K7L)
R29  value 4K7  [RES-0805]  (hidden comment: RT0805FRE134K7L)
R30  value 4K7  [RES-0805]  (hidden comment: RT0805FRE134K7L)
R31  value 680K  [RES-1206]  (hidden comment: RT1206FRE07680KL)
R32  value 50K  [TC33X2503E]  (hidden comment: EVEN)
R33  value 680K  [RES-1206]  (hidden comment: RT1206FRE07680KL)
R34  value 680K  [RES-1206]  (hidden comment: RT1206FRE07680KL)
R35  value 680K  [RES-1206]  (hidden comment: RT1206FRE07680KL)
R36  value 680K  [RES-1206]  (hidden comment: RT1206FRE07680KL)
R37  value 680K  [RES-1206]  (hidden comment: RT1206FRE07680KL)
R38  value 680K  [RES-1206]  (hidden comment: RT1206FRE07680KL)
R39  value 680K  [RES-1206]  (hidden comment: RT1206FRE07680KL)
R40  value 680K  [RES-1206]  (hidden comment: RT1206FRE07680KL)
R41  value 47K  [RES-0805]  (hidden comment: RT0805FRE0747KL)
R42  value 47K  [RES-0805]  (hidden comment: RT0805FRE0747KL)
R43  value 47K  [RES-0805]  (hidden comment: RT0805FRE0747KL)
R44  value 680K  [RES-1206]  (hidden comment: RT1206FRE07680KL)
R45  value 680K  [RES-1206]  (hidden comment: RT1206FRE07680KL)
R46  value 680K  [RES-1206]  (hidden comment: RT1206FRE07680KL)
R47  value 680K  [RES-1206]  (hidden comment: RT1206FRE07680KL)
R48  value 680K  [RES-1206]  (hidden comment: RT1206FRE07680KL)
R49  value 680K  [RES-1206]  (hidden comment: RT1206FRE07680KL)
R50  value 680K  [RES-1206]  (hidden comment: RT1206FRE07680KL)
R51  value 680K  [RES-1206]  (hidden comment: RT1206FRE07680KL)
R52  value 47K  [RES-0805]  (hidden comment: RT0805FRE0747KL)
R53  value 47K  [RES-0805]  (hidden comment: RT0805FRE0747KL)
R54  value 47K  [RES-0805]  (hidden comment: RT0805FRE0747KL)
R55  value 47K  [RES-0805]  (hidden comment: RT0805FRE0747KL)
R56  value 47K  [RES-0805]  (hidden comment: RT0805FRE0747KL)
R57  value 47K  [RES-0805]  (hidden comment: RT0805FRE0747KL)
R58  value 47K  [RES-0805]  (hidden comment: RT0805FRE0747KL)
R59  value 47K  [RES-0805]  (hidden comment: RT0805FRE0747KL)
R60  value 47K  [RES-0805]  (hidden comment: RT0805FRE0747KL)
R61  value 47K  [RES-0805]  (hidden comment: RT0805FRE0747KL)
R62  value 47K  [RES-0805]  (hidden comment: RT0805FRE0747KL)
R63  value 47K  [RES-0805]  (hidden comment: RT0805FRE0747KL)

### Ports
NIXIE 1 - DIGIT 01 (in), NIXIE 1 - DIGIT 23 (in), NIXIE 1 - DIGIT 45 (in), NIXIE 1 - DIGIT 67 (in), NIXIE 1 - DIGIT 89 (in), NIXIE 2 - DIGIT 01 (in), NIXIE 2 - DIGIT 23 (in), NIXIE 2 - DIGIT 45 (in), NIXIE 2 - DIGIT 67 (in), NIXIE 2 - DIGIT 89 (in), NIXIE 3 - DIGIT 01 (in), NIXIE 3 - DIGIT 23 (in), NIXIE 3 - DIGIT 45 (in), NIXIE 3 - DIGIT 67 (in), NIXIE 3 - DIGIT 89 (in), NIXIE 4 - DIGIT 01 (in), NIXIE 4 - DIGIT 23 (in), NIXIE 4 - DIGIT 45 (in), NIXIE 4 - DIGIT 67 (in), NIXIE 4 - DIGIT 89 (in), PLATE SEL1 (in), PLATE SEL2 (in), PLATE SEL3 (in), PLATE SEL4 (in)

### Nets
B+: R16.2 R17.2 R18.2 R19.2 R20.2 R21.2 R26.2 R27.2 R28.2 R29.2 R30.2 R31.2
GND: Q25.2(E) Q27.2(E) Q29.2(E) Q31.2(E) R23.1 R24.1 R25.1 R41.1 R42.1 R43.1 R60.2 R61.2 R62.2 R63.2
VCC: R52.2 R53.2 R54.2 R55.2
VCOM: D5.4(S) D6.4(S) D7.4(S) D8.4(S)
EVEN CS VOLTAGE: Q10.1(B) Q11.1(B) Q12.1(B) Q13.1(B) Q14.1(B)
NIXIE 1 - DIGIT 01: D5.8(0) D5.14(1) ; port NIXIE 1 - DIGIT 01
NIXIE 1 - DIGIT 23: D5.9(2) D5.11(3) ; port NIXIE 1 - DIGIT 23
NIXIE 1 - DIGIT 45: D5.1(4) D5.12(5) ; port NIXIE 1 - DIGIT 45
NIXIE 1 - DIGIT 67: D5.2(6) D5.6(7) ; port NIXIE 1 - DIGIT 67
NIXIE 1 - DIGIT 89: D5.3(8) D5.5(9) ; port NIXIE 1 - DIGIT 89
NIXIE 2 - DIGIT 01: D6.8(0) D6.14(1) ; port NIXIE 2 - DIGIT 01
NIXIE 2 - DIGIT 23: D6.9(2) D6.11(3) ; port NIXIE 2 - DIGIT 23
NIXIE 2 - DIGIT 45: D6.1(4) D6.12(5) ; port NIXIE 2 - DIGIT 45
NIXIE 2 - DIGIT 67: D6.2(6) D6.6(7) ; port NIXIE 2 - DIGIT 67
NIXIE 2 - DIGIT 89: D6.3(8) D6.5(9) ; port NIXIE 2 - DIGIT 89
NIXIE 3 - DIGIT 01: D7.8(0) D7.14(1) ; port NIXIE 3 - DIGIT 01
NIXIE 3 - DIGIT 23: D7.9(2) D7.11(3) ; port NIXIE 3 - DIGIT 23
NIXIE 3 - DIGIT 45: D7.1(4) D7.12(5) ; port NIXIE 3 - DIGIT 45
NIXIE 3 - DIGIT 67: D7.2(6) D7.6(7) ; port NIXIE 3 - DIGIT 67
NIXIE 3 - DIGIT 89: D7.3(8) D7.5(9) ; port NIXIE 3 - DIGIT 89
NIXIE 4 - DIGIT 01: D8.8(0) D8.14(1) ; port NIXIE 4 - DIGIT 01
NIXIE 4 - DIGIT 23: D8.9(2) D8.11(3) ; port NIXIE 4 - DIGIT 23
NIXIE 4 - DIGIT 45: D8.1(4) D8.12(5) ; port NIXIE 4 - DIGIT 45
NIXIE 4 - DIGIT 67: D8.2(6) D8.6(7) ; port NIXIE 4 - DIGIT 67
NIXIE 4 - DIGIT 89: D8.3(8) D8.5(9) ; port NIXIE 4 - DIGIT 89
NX1 P1: D5.13(P1) Q16.3(C)
NX1 P2: D5.10(P2) Q17.3(C)
NX2 P1: D6.13(P1) Q18.3(C)
NX2 P2: D6.10(P2) Q19.3(C)
NX3 P1: D7.13(P1) Q20.3(C)
NX3 P2: D7.10(P2) Q21.3(C)
NX4 P1: D8.13(P1) Q22.3(C)
NX4 P2: D8.10(P2) Q23.3(C)
NX11C: Q11.3(C) Q16.2(E) R33.2
NX11E: Q11.2(E) R27.1
NX12C: Q5.3(C) Q17.2(E) R34.2
NX12E: Q5.2(E) R17.1
NX21C: Q12.3(C) Q18.2(E) R35.2
NX21E: Q12.2(E) R28.1
NX22C: Q6.3(C) Q19.2(E) R36.2
NX22E: Q6.2(E) R18.1
NX31C: Q13.3(C) Q20.2(E) R37.2
NX31E: Q13.2(E) R29.1
NX32C: Q7.3(C) Q21.2(E) R38.2
NX32E: Q7.2(E) R19.1
NX41C: Q14.3(C) Q22.2(E) R39.2
NX41E: Q14.2(E) R30.1
NX42C: Q8.3(C) Q23.2(E) R40.2
NX42E: Q8.2(E) R20.1
NXECSC: Q10.3(C) Q15.3(C)
NXECSE: Q10.2(E) R26.1
NXOCSC: Q4.3(C) Q9.3(C)
NXOCSE: Q4.2(E) R16.1
ODD CS VOLTAGE: Q4.1(B) Q5.1(B) Q6.1(B) Q7.1(B) Q8.1(B)
PLATE SEL1: Q24.2(E) ; port PLATE SEL1
PLATE SEL2: Q26.2(E) ; port PLATE SEL2
PLATE SEL3: Q28.2(E) ; port PLATE SEL3
PLATE SEL4: Q30.2(E) ; port PLATE SEL4
NetQ9_1: Q9.1(B) R22.2
NetQ9_2: Q9.2(E) R25.2
NetQ15_1: Q15.1(B) R32.2
NetQ15_2: Q15.2(E) R43.2
NetQ16_1: Q16.1(B) R33.1 R44.2
NetQ17_1: Q17.1(B) R34.1 R45.2
NetQ18_1: Q18.1(B) R35.1 R46.2
NetQ19_1: Q19.1(B) R36.1 R47.2
NetQ20_1: Q20.1(B) R37.1 R48.2
NetQ21_1: Q21.1(B) R38.1 R49.2
NetQ22_1: Q22.1(B) R39.1 R50.2
NetQ23_1: Q23.1(B) R40.1 R51.2
NetQ24_1: Q24.1(B) R52.1 R56.2
NetQ24_3: Q24.3(C) R44.1
NetQ25_1: Q25.1(B) R56.1 R60.1
NetQ25_3: Q25.3(C) R45.1
NetQ26_1: Q26.1(B) R53.1 R57.2
NetQ26_3: Q26.3(C) R46.1
NetQ27_1: Q27.1(B) R57.1 R61.1
NetQ27_3: Q27.3(C) R47.1
NetQ28_1: Q28.1(B) R54.1 R58.2
NetQ28_3: Q28.3(C) R48.1
NetQ29_1: Q29.1(B) R58.1 R62.1
NetQ29_3: Q29.3(C) R49.1
NetQ30_1: Q30.1(B) R55.1 R59.2
NetQ30_3: Q30.3(C) R50.1
NetQ31_1: Q31.1(B) R59.1 R63.1
NetQ31_3: Q31.3(C) R51.1
NetR21_1: R21.1 R22.3
NetR22_1: R22.1 R23.2 R24.2
NetR31_1: R31.1 R32.3
NetR32_1: R32.1 R41.2 R42.2

### Notes on the sheet
- (near R16) ODD DIGITS
- (near R16) CURRENT SOURCE
- (near R26) EVEN DIGITS
- (near R26) CURRENT SOURCE
- DESIGN NOTE:
  Potentiometers adjust nixie brightness by changing the anode current.
  Range: 0.7 mA to 2.9 mA
- DESIGN NOTE:
  There are two independent current sources so that the odd digits that are located in the back of the nixie can be driven with higer current to make them more visible.
- DESIGN NOTE:
  All resistor that are subject to HIGH VOLTAGE must be 1206 in size
- Title:
- Project:
- Sheet:
- Author:
- of
- Revision:
- Date:
- (in symbol IN-4 NIXIE) EVEN; ODD
- (in symbol POT-50K-TC33X-2-503E) CW

### Library data of the parts
Q4-Q8 Q10-Q14 Q16-Q23 = PNP-MMBTA92: as Q2 on sheet [03] - POWER; Supplier 1: Mouser; Supplier Part Number 1: 621-MMBTA92-F
Q9 Q15 Q24-Q31 = NPN-MMBTA42: 300V NPN SMALL SIGNAL TRANSISTOR IN SOT23; Supplier 1: Mouser; Supplier Part Number 1: 621-MMBTA42-F
R16 R23-R26 R41-R43 R52-R63 = RES-0805-47K-RT0805FRE0747KL: as R14 on sheet [03] - POWER; Tolerance: 1%; Supplier 1: Mouser; Supplier Part Number 1: 603-RT0805FRE0747KL
R17-R20 R27-R30 = RES-0805-4K7-RT0805FRE134K7L: as R1 on sheet [03] - POWER; Tolerance: 1%; Supplier 1: Mouser; Supplier Part Number 1: 603-RT0805FRE134K7L
R21 R31 R33-R40 R44-R51 = RES-1206-680K-RT1206FRE07680KL: as R4 on sheet [03] - POWER; Tolerance: 1%; Supplier 1: Mouser; Supplier Part Number 1: 603-RT1206FRE07680KL
R22 R32 = POT-50K-TC33X-2-503E: Resistenze trimmer - SMD 3MM 50KOHMS 25% 0.1WATT OPEN FRM; Manufacturer: Yageo; Power Rating: 1/10W; Voltage Rating: 75V; Tolerance: 1%; Supplier 1: Mouser; Supplier Part Number 1: 652-TC33X-2-503E

## Sheet [06] - NEON.SchDoc
size A3; DocumentNumber: 6; SheetNumber: 6; SheetTotal: 6
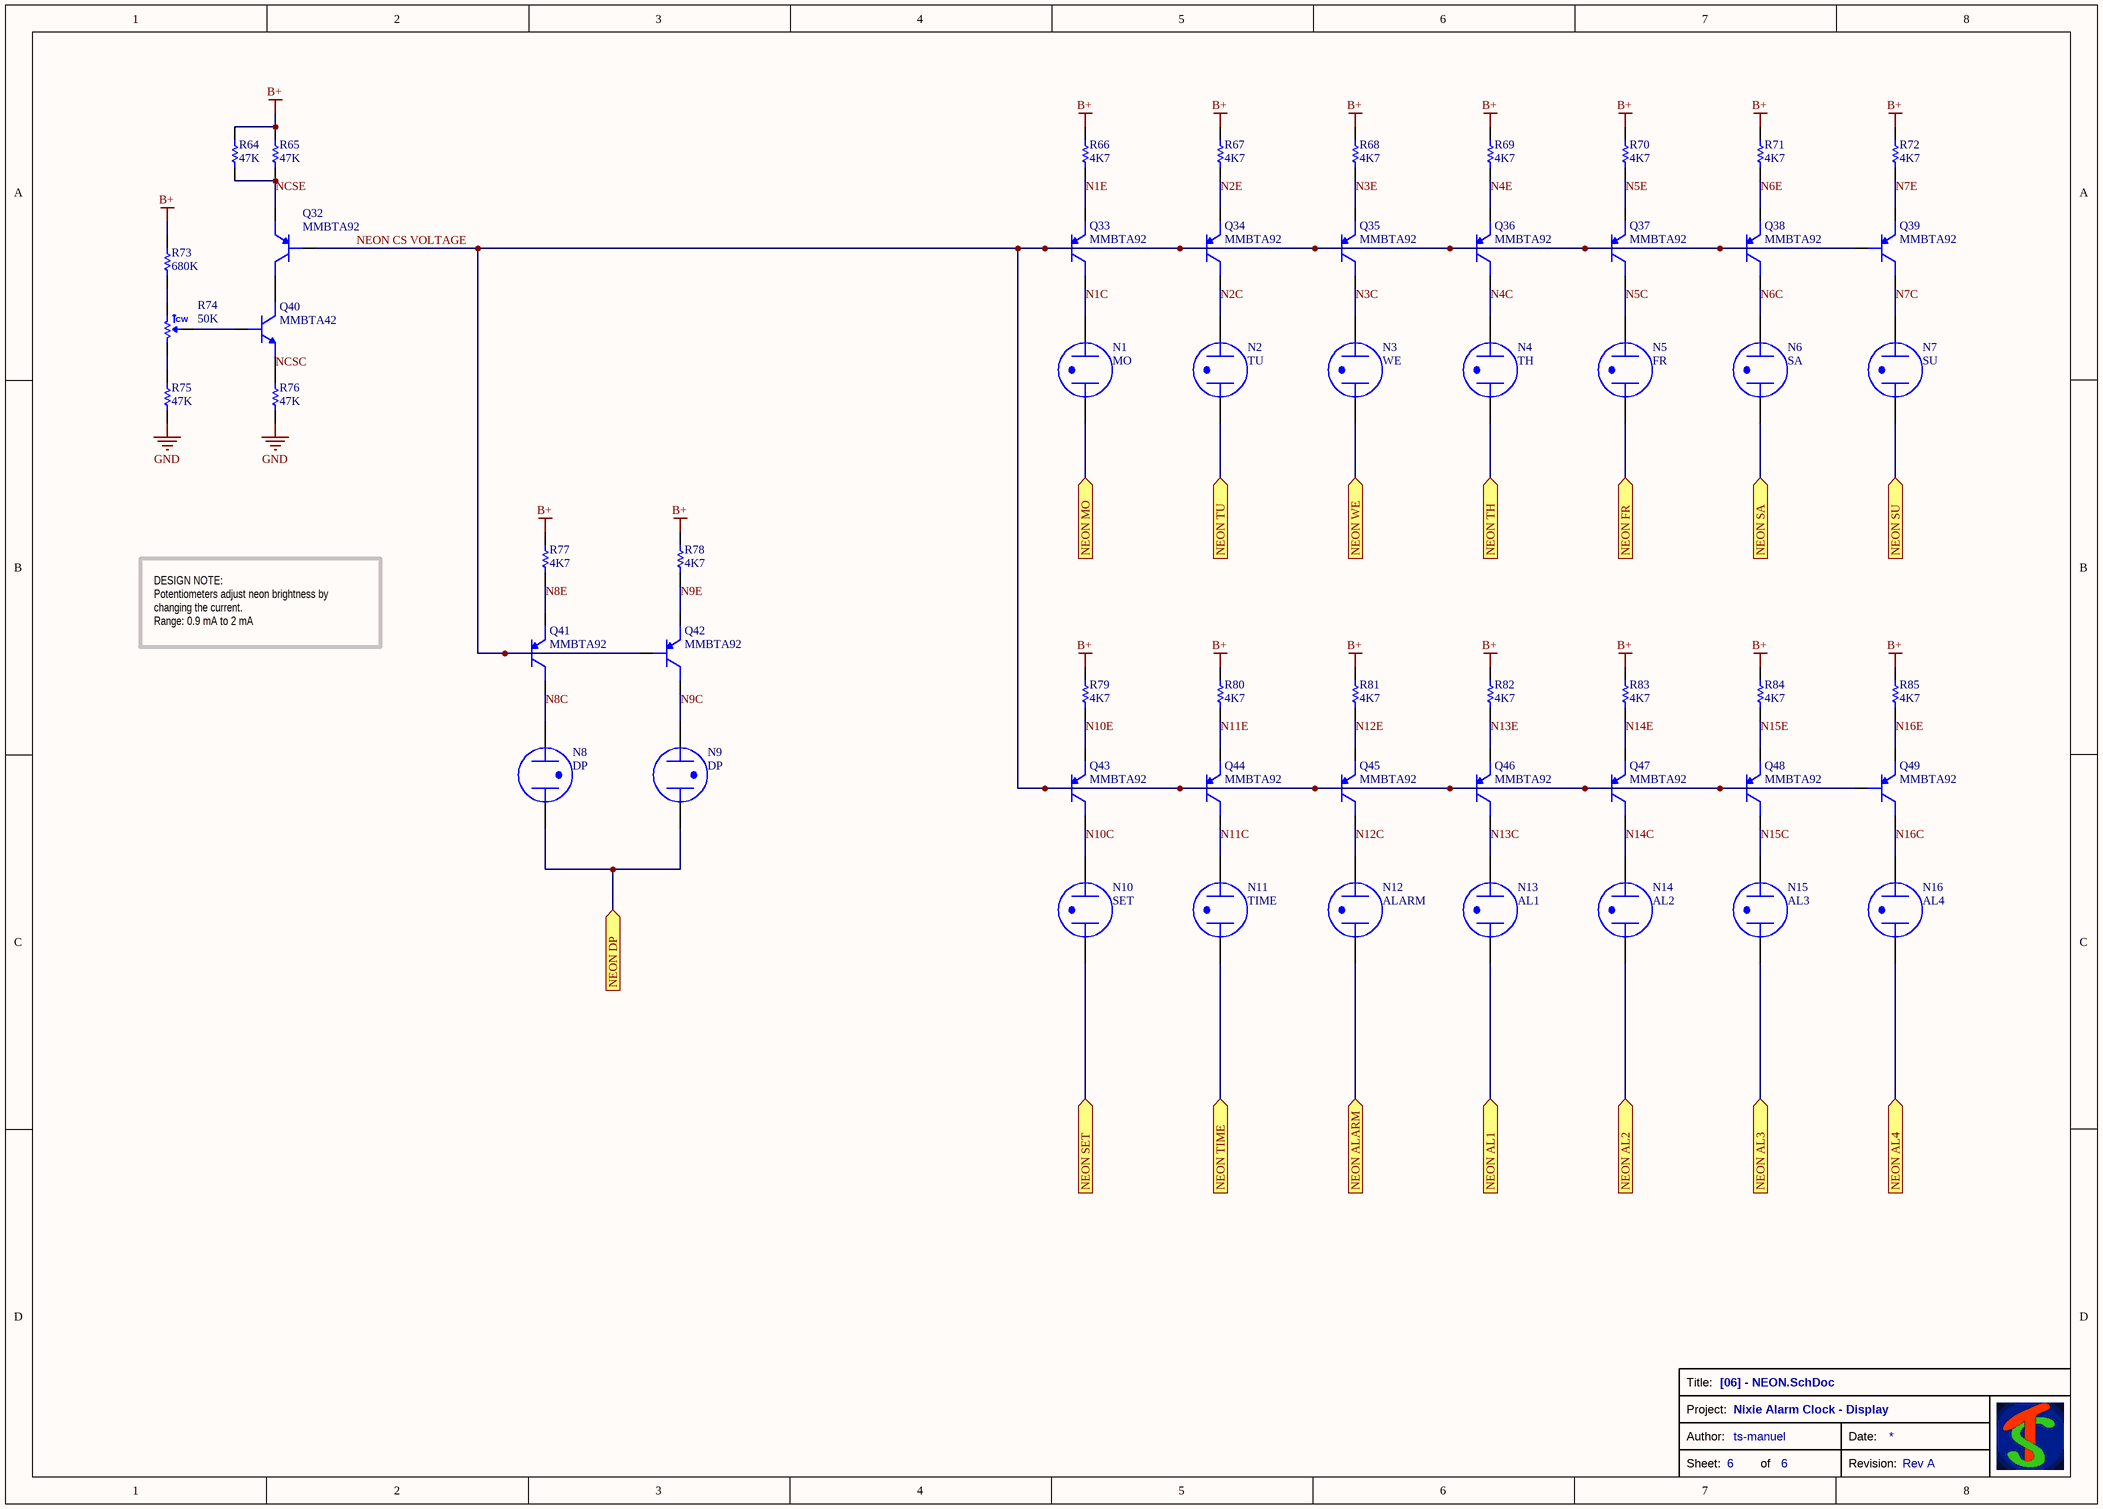
[diagram p5: [06] - NEON.SchDoc]

### Parts
N1  MO  [NE4 NEON LAMP]
N2  TU  [NE4 NEON LAMP]
N3  WE  [NE4 NEON LAMP]
N4  TH  [NE4 NEON LAMP]
N5  FR  [NE4 NEON LAMP]
N6  SA  [NE4 NEON LAMP]
N7  SU  [NE4 NEON LAMP]
N8  DP  [NE4 NEON LAMP]
N9  DP  [NE4 NEON LAMP]
N10  SET  [NE4 NEON LAMP]
N11  TIME  [NE4 NEON LAMP]
N12  ALARM  [NE4 NEON LAMP]
N13  AL1  [NE4 NEON LAMP]
N14  AL2  [NE4 NEON LAMP]
N15  AL3  [NE4 NEON LAMP]
N16  AL4  [NE4 NEON LAMP]
Q32  MMBTA92  [SOT95P240X110-3N]
Q33  MMBTA92  [SOT95P240X110-3N]
Q34  MMBTA92  [SOT95P240X110-3N]
Q35  MMBTA92  [SOT95P240X110-3N]
Q36  MMBTA92  [SOT95P240X110-3N]
Q37  MMBTA92  [SOT95P240X110-3N]
Q38  MMBTA92  [SOT95P240X110-3N]
Q39  MMBTA92  [SOT95P240X110-3N]
Q40  MMBTA42  [SOT95P240X110-3N]
Q41  MMBTA92  [SOT95P240X110-3N]
Q42  MMBTA92  [SOT95P240X110-3N]
Q43  MMBTA92  [SOT95P240X110-3N]
Q44  MMBTA92  [SOT95P240X110-3N]
Q45  MMBTA92  [SOT95P240X110-3N]
Q46  MMBTA92  [SOT95P240X110-3N]
Q47  MMBTA92  [SOT95P240X110-3N]
Q48  MMBTA92  [SOT95P240X110-3N]
Q49  MMBTA92  [SOT95P240X110-3N]
R64  value 47K  [RES-0805]  (hidden comment: RT0805FRE0747KL)
R65  value 47K  [RES-0805]  (hidden comment: RT0805FRE0747KL)
R66  value 4K7  [RES-0805]  (hidden comment: RT0805FRE134K7L)
R67  value 4K7  [RES-0805]  (hidden comment: RT0805FRE134K7L)
R68  value 4K7  [RES-0805]  (hidden comment: RT0805FRE134K7L)
R69  value 4K7  [RES-0805]  (hidden comment: RT0805FRE134K7L)
R70  value 4K7  [RES-0805]  (hidden comment: RT0805FRE134K7L)
R71  value 4K7  [RES-0805]  (hidden comment: RT0805FRE134K7L)
R72  value 4K7  [RES-0805]  (hidden comment: RT0805FRE134K7L)
R73  value 680K  [RES-1206]  (hidden comment: RT1206FRE07680KL)
R74  value 50K  [TC33X2503E]  (hidden comment: NEON)
R75  value 47K  [RES-0805]  (hidden comment: RT0805FRE0747KL)
R76  value 47K  [RES-0805]  (hidden comment: RT0805FRE0747KL)
R77  value 4K7  [RES-0805]  (hidden comment: RT0805FRE134K7L)
R78  value 4K7  [RES-0805]  (hidden comment: RT0805FRE134K7L)
R79  value 4K7  [RES-0805]  (hidden comment: RT0805FRE134K7L)
R80  value 4K7  [RES-0805]  (hidden comment: RT0805FRE134K7L)
R81  value 4K7  [RES-0805]  (hidden comment: RT0805FRE134K7L)
R82  value 4K7  [RES-0805]  (hidden comment: RT0805FRE134K7L)
R83  value 4K7  [RES-0805]  (hidden comment: RT0805FRE134K7L)
R84  value 4K7  [RES-0805]  (hidden comment: RT0805FRE134K7L)
R85  value 4K7  [RES-0805]  (hidden comment: RT0805FRE134K7L)

### Ports
NEON AL1 (in), NEON AL2 (in), NEON AL3 (in), NEON AL4 (in), NEON ALARM (in), NEON DP (in), NEON FR (in), NEON MO (in), NEON SA (in), NEON SET (in), NEON SU (in), NEON TH (in), NEON TIME (in), NEON TU (in), NEON WE (in)

### Nets
B+: R64.2 R65.2 R66.2 R67.2 R68.2 R69.2 R70.2 R71.2 R72.2 R73.2 R77.2 R78.2 R79.2 R80.2 R81.2 R82.2 R83.2 R84.2 R85.2
GND: R75.1 R76.1
N1C: N1.2 Q33.3(C)
N1E: Q33.2(E) R66.1
N2C: N2.2 Q34.3(C)
N2E: Q34.2(E) R67.1
N3C: N3.2 Q35.3(C)
N3E: Q35.2(E) R68.1
N4C: N4.2 Q36.3(C)
N4E: Q36.2(E) R69.1
N5C: N5.2 Q37.3(C)
N5E: Q37.2(E) R70.1
N6C: N6.2 Q38.3(C)
N6E: Q38.2(E) R71.1
N7C: N7.2 Q39.3(C)
N7E: Q39.2(E) R72.1
N8C: N8.1 Q41.3(C)
N8E: Q41.2(E) R77.1
N9C: N9.1 Q42.3(C)
N9E: Q42.2(E) R78.1
N10C: N10.2 Q43.3(C)
N10E: Q43.2(E) R79.1
N11C: N11.2 Q44.3(C)
N11E: Q44.2(E) R80.1
N12C: N12.2 Q45.3(C)
N12E: Q45.2(E) R81.1
N13C: N13.2 Q46.3(C)
N13E: Q46.2(E) R82.1
N14C: N14.2 Q47.3(C)
N14E: Q47.2(E) R83.1
N15C: N15.2 Q48.3(C)
N15E: Q48.2(E) R84.1
N16C: N16.2 Q49.3(C)
N16E: Q49.2(E) R85.1
NCSC: Q40.2(E) R76.2
NCSE: Q32.2(E) R64.1 R65.1
NEON AL1: N13.1 ; port NEON AL1
NEON AL2: N14.1 ; port NEON AL2
NEON AL3: N15.1 ; port NEON AL3
NEON AL4: N16.1 ; port NEON AL4
NEON ALARM: N12.1 ; port NEON ALARM
NEON CS VOLTAGE: Q32.1(B) Q33.1(B) Q34.1(B) Q35.1(B) Q36.1(B) Q37.1(B) Q38.1(B) Q39.1(B) Q41.1(B) Q42.1(B) Q43.1(B) Q44.1(B) Q45.1(B) Q46.1(B) Q47.1(B) Q48.1(B) Q49.1(B)
NEON DP: N8.2 N9.2 ; port NEON DP
NEON FR: N5.1 ; port NEON FR
NEON MO: N1.1 ; port NEON MO
NEON SA: N6.1 ; port NEON SA
NEON SET: N10.1 ; port NEON SET
NEON SU: N7.1 ; port NEON SU
NEON TH: N4.1 ; port NEON TH
NEON TIME: N11.1 ; port NEON TIME
NEON TU: N2.1 ; port NEON TU
NEON WE: N3.1 ; port NEON WE
NetQ32_3: Q32.3(C) Q40.3(C)
NetQ40_1: Q40.1(B) R74.2
NetR73_1: R73.1 R74.3
NetR74_1: R74.1 R75.2

### Notes on the sheet
- DESIGN NOTE:
  Potentiometers adjust neon brightness by changing the current.
  Range: 0.9 mA to 2 mA
- Title:
- Project:
- Sheet:
- Author:
- of
- Revision:
- Date:
- (in symbol POT-50K-TC33X-2-503E) CW

### Library data of the parts
N1-N16 = T4-NEON-LAMP: Lampade Std. Brightness Neon Lamp Tin Leads; Supplier 1: Mouser; Supplier Part Number 1: 696-GT-NE4H1125
Q32-Q39 Q41-Q49 = PNP-MMBTA92: as Q2 on sheet [03] - POWER; Supplier 1: Mouser; Supplier Part Number 1: 621-MMBTA92-F
Q40 = NPN-MMBTA42: as Q9 on sheet [05] - NIXIE; Supplier 1: Mouser; Supplier Part Number 1: 621-MMBTA42-F
R64 R65 R75 R76 = RES-0805-47K-RT0805FRE0747KL: as R14 on sheet [03] - POWER; Tolerance: 1%; Supplier 1: Mouser; Supplier Part Number 1: 603-RT0805FRE0747KL
R66-R72 R77-R85 = RES-0805-4K7-RT0805FRE134K7L: as R1 on sheet [03] - POWER; Tolerance: 1%; Supplier 1: Mouser; Supplier Part Number 1: 603-RT0805FRE134K7L
R73 = RES-1206-680K-RT1206FRE07680KL: as R4 on sheet [03] - POWER; Tolerance: 1%; Supplier 1: Mouser; Supplier Part Number 1: 603-RT1206FRE07680KL
R74 = POT-50K-TC33X-2-503E: as R22 on sheet [05] - NIXIE; Supplier 1: Mouser; Supplier Part Number 1: 652-TC33X-2-503E

## Nets that join several sheets
B+: [03] - POWER (9 pins), [05] - NIXIE (12 pins), [06] - NEON (19 pins)
GND: [03] - POWER (29 pins), [04] - DRIVERS (21 pins), [05] - NIXIE (14 pins), [06] - NEON (R75.1 R76.1)
VCC: [03] - POWER (7 pins), [04] - DRIVERS (11 pins), [05] - NIXIE (R52.2 R53.2 R54.2 R55.2)
VCOM: [03] - POWER (D3.2 R9.1 TP4.1), [04] - DRIVERS (5 pins), [05] - NIXIE (D5.4 D6.4 D7.4 D8.4)
CLK: [03] - POWER (R2.1), [04] - DRIVERS (5 pins)
DATA: [03] - POWER (R3.1), [04] - DRIVERS (U2.14)
HV ENABLE: [03] - POWER (R14.1), [04] - DRIVERS (U4.15)
LATCH: [03] - POWER (R1.1), [04] - DRIVERS (5 pins)
NEON AL1: [04] - DRIVERS (U5.13), [06] - NEON (N13.1)
NEON AL2: [04] - DRIVERS (U5.12), [06] - NEON (N14.1)
NEON AL3: [04] - DRIVERS (U5.11), [06] - NEON (N15.1)
NEON AL4: [04] - DRIVERS (U5.10), [06] - NEON (N16.1)
NEON ALARM: [04] - DRIVERS (U5.15), [06] - NEON (N12.1)
NEON DP: [04] - DRIVERS (U9.13), [06] - NEON (N8.2 N9.2)
NEON FR: [04] - DRIVERS (U3.14), [06] - NEON (N5.1)
NEON MO: [04] - DRIVERS (U3.10), [06] - NEON (N1.1)
NEON SA: [04] - DRIVERS (U3.15), [06] - NEON (N6.1)
NEON SET: [04] - DRIVERS (U5.14), [06] - NEON (N10.1)
NEON SU: [04] - DRIVERS (U3.16), [06] - NEON (N7.1)
NEON TH: [04] - DRIVERS (U3.13), [06] - NEON (N4.1)
NEON TIME: [04] - DRIVERS (U5.16), [06] - NEON (N11.1)
NEON TU: [04] - DRIVERS (U3.11), [06] - NEON (N2.1)
NEON WE: [04] - DRIVERS (U3.12), [06] - NEON (N3.1)
NIXIE 1 - DIGIT 01: [04] - DRIVERS (U11.11), [05] - NIXIE (D5.8 D5.14)
NIXIE 1 - DIGIT 23: [04] - DRIVERS (U11.10), [05] - NIXIE (D5.9 D5.11)
NIXIE 1 - DIGIT 45: [04] - DRIVERS (U11.12), [05] - NIXIE (D5.1 D5.12)
NIXIE 1 - DIGIT 67: [04] - DRIVERS (U11.13), [05] - NIXIE (D5.2 D5.6)
NIXIE 1 - DIGIT 89: [04] - DRIVERS (U11.14), [05] - NIXIE (D5.3 D5.5)
NIXIE 2 - DIGIT 01: [04] - DRIVERS (U9.10), [05] - NIXIE (D6.8 D6.14)
NIXIE 2 - DIGIT 23: [04] - DRIVERS (U11.15), [05] - NIXIE (D6.9 D6.11)
NIXIE 2 - DIGIT 45: [04] - DRIVERS (U11.16), [05] - NIXIE (D6.1 D6.12)
NIXIE 2 - DIGIT 67: [04] - DRIVERS (U9.11), [05] - NIXIE (D6.2 D6.6)
NIXIE 2 - DIGIT 89: [04] - DRIVERS (U9.12), [05] - NIXIE (D6.3 D6.5)
NIXIE 3 - DIGIT 01: [04] - DRIVERS (U9.15), [05] - NIXIE (D7.8 D7.14)
NIXIE 3 - DIGIT 23: [04] - DRIVERS (U9.14), [05] - NIXIE (D7.9 D7.11)
NIXIE 3 - DIGIT 45: [04] - DRIVERS (U9.16), [05] - NIXIE (D7.1 D7.12)
NIXIE 3 - DIGIT 67: [04] - DRIVERS (U7.11), [05] - NIXIE (D7.2 D7.6)
NIXIE 3 - DIGIT 89: [04] - DRIVERS (U7.10), [05] - NIXIE (D7.3 D7.5)
NIXIE 4 - DIGIT 01: [04] - DRIVERS (U7.13), [05] - NIXIE (D8.8 D8.14)
NIXIE 4 - DIGIT 23: [04] - DRIVERS (U7.15), [05] - NIXIE (D8.9 D8.11)
NIXIE 4 - DIGIT 45: [04] - DRIVERS (U7.16), [05] - NIXIE (D8.1 D8.12)
NIXIE 4 - DIGIT 67: [04] - DRIVERS (U7.12), [05] - NIXIE (D8.2 D8.6)
NIXIE 4 - DIGIT 89: [04] - DRIVERS (U7.14), [05] - NIXIE (D8.3 D8.5)
PLATE SEL1: [04] - DRIVERS (U10.15), [05] - NIXIE (Q24.2)
PLATE SEL2: [04] - DRIVERS (U8.15), [05] - NIXIE (Q26.2)
PLATE SEL3: [04] - DRIVERS (U6.15), [05] - NIXIE (Q28.2)
PLATE SEL4: [04] - DRIVERS (U2.15), [05] - NIXIE (Q30.2)